# EAGLE schematic hanover-7320-20-01 (EAGLE 9.6.1), part 1 of 4

## Sheet 1 of 7: Logic
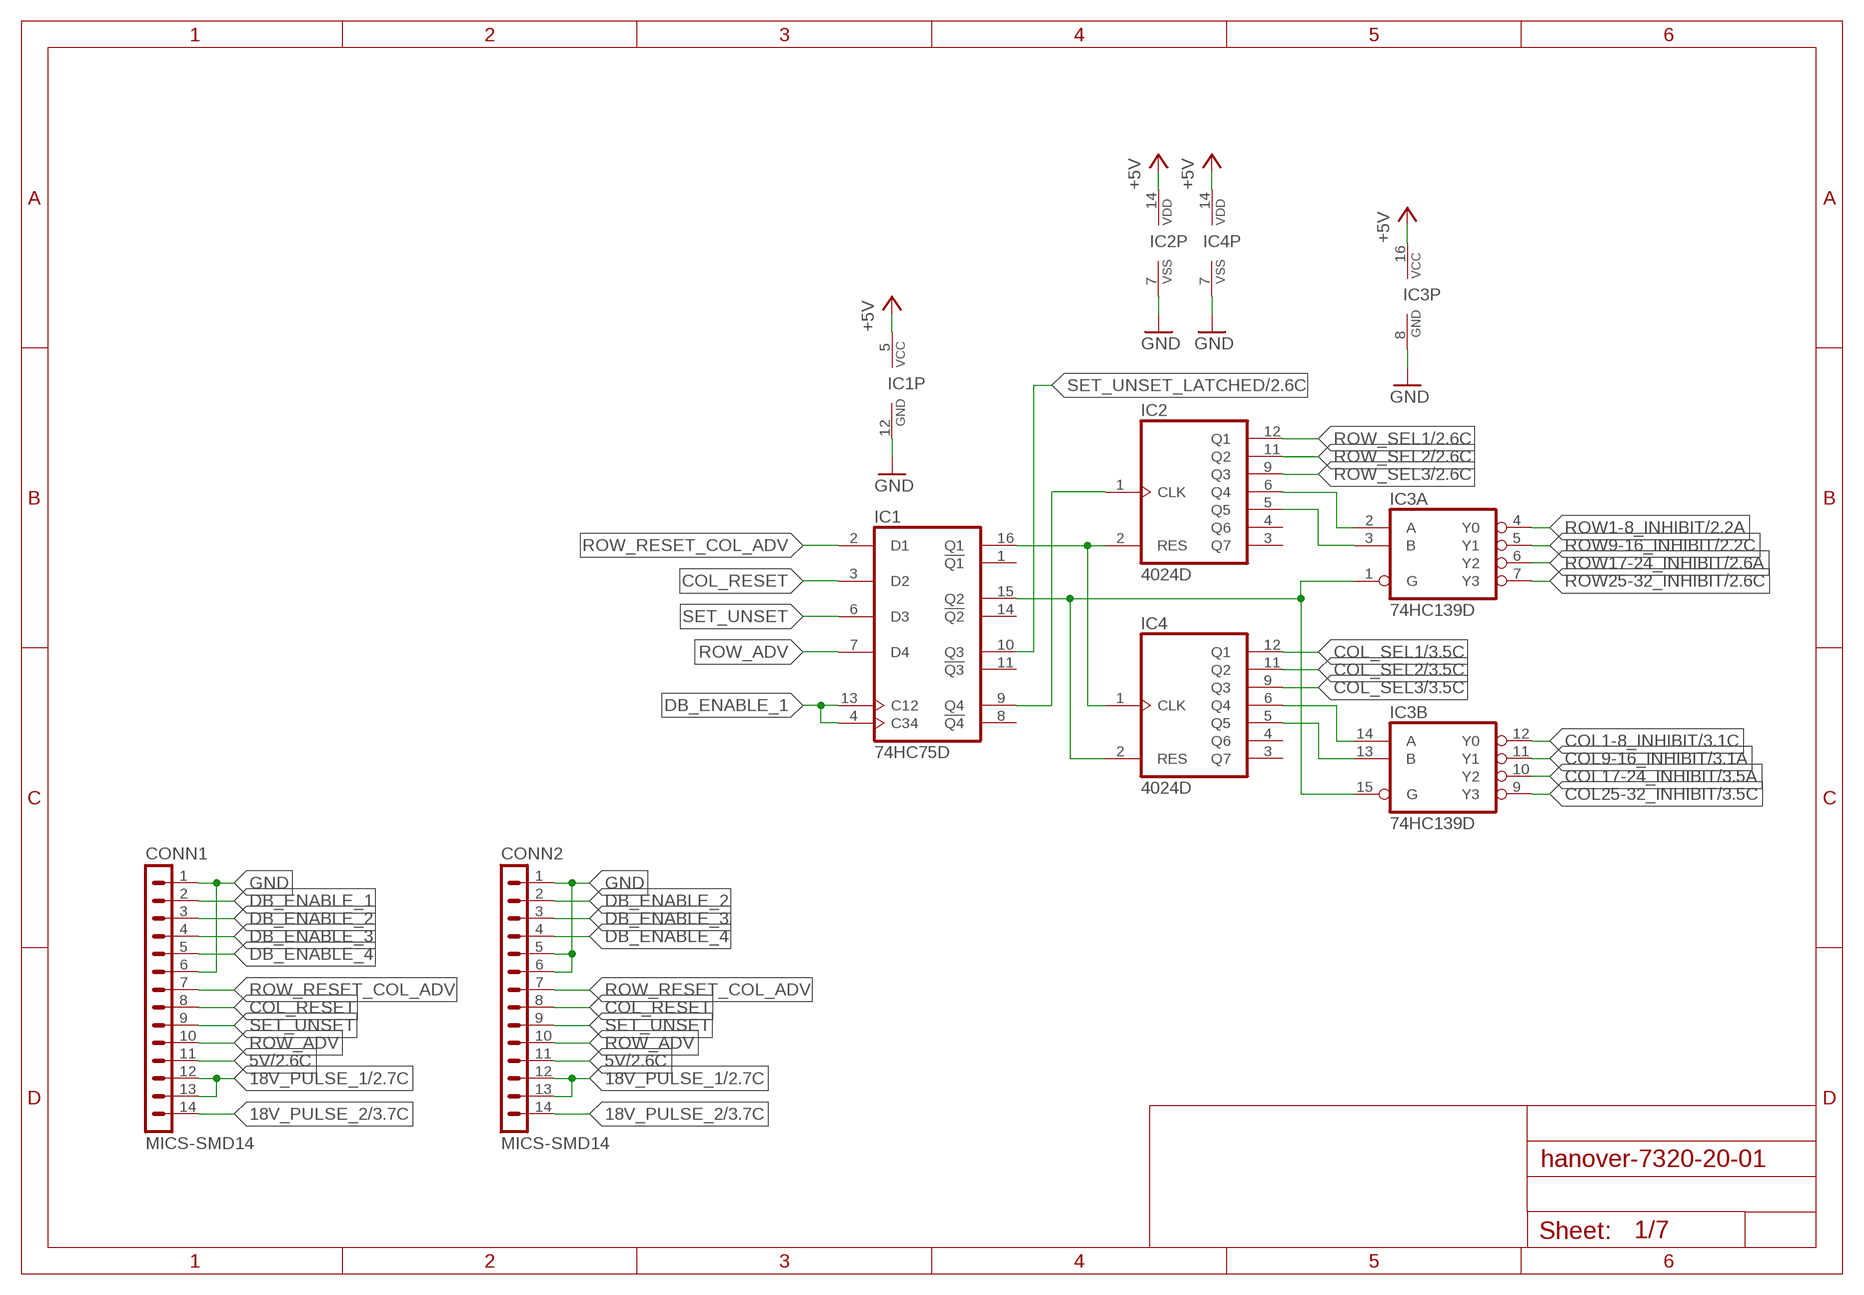
[diagram p0: schematic, sheet 1]

### Parts
CONN1  MICS-SMD14  [MICSMD14]
CONN2  MICS-SMD14  [MICSMD14]
IC1  74HC75D  [SO16]
IC2  4024D  [SO14]
IC3  74HC139D  [SO16]
IC4  4024D  [SO14]

### Nets
5V: CONN1.11 CONN2.11 ; also sheet 2,3
18V_PULSE_1: CONN1.12 CONN1.13 CONN2.12 CONN2.13 ; also sheet 2,3
18V_PULSE_2: CONN1.14 CONN2.14 ; also sheet 3
+5V: IC1.5(VCC) IC2.14(VDD) IC3.16(P:VCC) IC4.14(VDD) ; also sheet 2,3
COL1-8_INHIBIT: IC3.12(B:Y0) ; also sheet 3
COL9-16_INHIBIT: IC3.11(B:Y1) ; also sheet 3
COL17-24_INHIBIT: IC3.10(B:Y2) ; also sheet 3
COL25-32_INHIBIT: IC3.9(B:Y3) ; also sheet 3
COL_RESET: CONN1.8 CONN2.8 IC1.3(D2)
COL_SEL1: IC4.12(Q1) ; also sheet 3
COL_SEL2: IC4.11(Q2) ; also sheet 3
COL_SEL3: IC4.9(Q3) ; also sheet 3
DB_ENABLE_1: CONN1.2 IC1.4(C34) IC1.13(C12)
DB_ENABLE_2: CONN1.3 CONN2.2
DB_ENABLE_3: CONN1.4 CONN2.3
DB_ENABLE_4: CONN1.5 CONN2.4
GND: CONN1.1 CONN1.6 CONN2.1 CONN2.5 CONN2.6 IC1.12(GND) IC2.7(VSS) IC3.8(P:GND) IC4.7(VSS) ; also sheet 2,3
N$1: IC1.9(Q4) IC2.1(CLK)
N$2: IC1.16(Q1) IC2.2(RES) IC4.1(CLK)
N$3: IC1.15(Q2) IC3.1(A:G) IC3.15(B:G) IC4.2(RES)
N$5: IC2.5(Q5) IC3.3(A:B)
N$6: IC3.14(B:A) IC4.6(Q4)
N$7: IC3.13(B:B) IC4.5(Q5)
ROW1-8_INHIBIT: IC3.4(A:Y0) ; also sheet 2
ROW9-16_INHIBIT: IC3.5(A:Y1) ; also sheet 2
ROW17-24_INHIBIT: IC3.6(A:Y2) ; also sheet 2
ROW25-32_INHIBIT: IC3.7(A:Y3) ; also sheet 2
ROW_ADV: CONN1.10 CONN2.10 IC1.7(D4)
ROW_RESET_COL_ADV: CONN1.7 CONN2.7 IC1.2(D1)
ROW_SEL1: IC2.12(Q1) ; also sheet 2
ROW_SEL2: IC2.11(Q2) ; also sheet 2
ROW_SEL3: IC2.9(Q3) ; also sheet 2
ROW_SEL4: IC2.6(Q4) IC3.2(A:A)
SET_UNSET: CONN1.9 CONN2.9 IC1.6(D3)
SET_UNSET_LATCHED: IC1.10(Q3) ; also sheet 2,3
Unconnected: IC1.1(!Q1) IC1.8(!Q4) IC1.11(!Q3) IC1.14(!Q2) IC2.3(Q7) IC2.4(Q6) IC4.3(Q7) IC4.4(Q6)

## Sheet 2 of 7: Row Latches and Drive
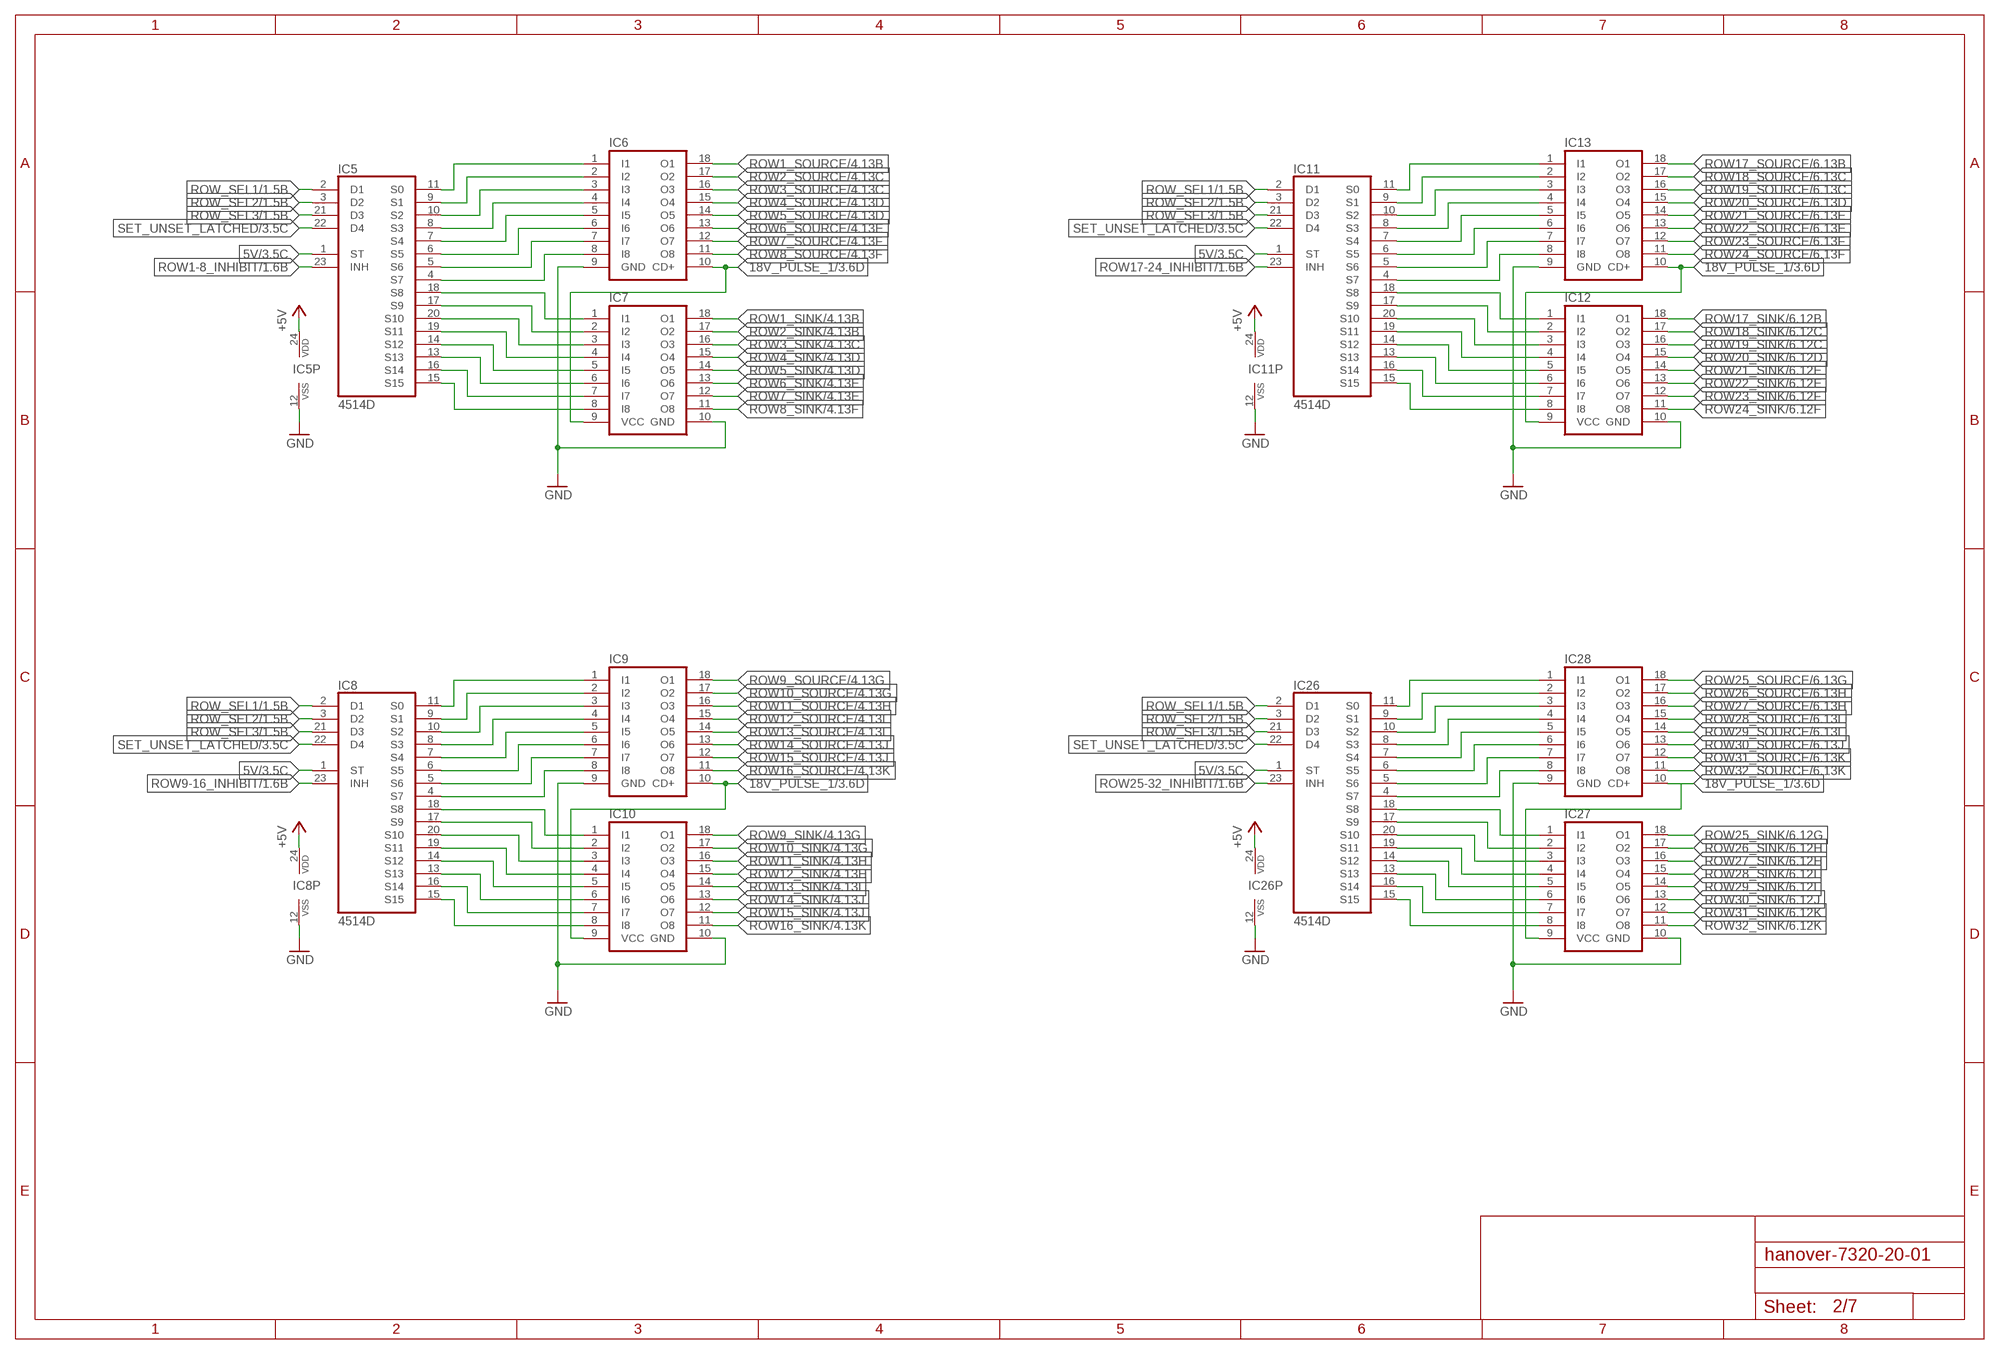
[diagram p1: schematic, sheet 2]

### Parts
IC5  4514D  [SO24W]
IC6  TBD62083AFG  [SOIC127P1030X245-18N]
IC7  TBD62783AFG  [SOIC127P1030X245-18N]
IC8  4514D  [SO24W]
IC9  TBD62083AFG  [SOIC127P1030X245-18N]
IC10  TBD62783AFG  [SOIC127P1030X245-18N]
IC11  4514D  [SO24W]
IC12  TBD62783AFG  [SOIC127P1030X245-18N]
IC13  TBD62083AFG  [SOIC127P1030X245-18N]
IC26  4514D  [SO24W]
IC27  TBD62783AFG  [SOIC127P1030X245-18N]
IC28  TBD62083AFG  [SOIC127P1030X245-18N]

### Nets
5V: IC5.1(ST) IC8.1(ST) IC11.1(ST) IC26.1(ST) ; also sheet 1,3
18V_PULSE_1: IC6.10(CD+) IC7.9(VCC) IC9.10(CD+) IC10.9(VCC) IC12.9(VCC) IC13.10(CD+) IC27.9(VCC) IC28.10(CD+) ; also sheet 1,3
+5V: IC5.24(VDD) IC8.24(VDD) IC11.24(VDD) IC26.24(VDD) ; also sheet 1,3
GND: IC5.12(VSS) IC6.9(GND) IC7.10(GND) IC8.12(VSS) IC9.9(GND) IC10.10(GND) IC11.12(VSS) IC12.10(GND) IC13.9(GND) IC26.12(VSS) IC27.10(GND) IC28.9(GND) ; also sheet 1,3
N$10: IC5.14(S12) IC7.5(I5)
N$12: IC11.14(S12) IC12.5(I5)
N$34: IC8.14(S12) IC10.5(I5)
R1_SINK: IC5.11(S0) IC6.1(I1)
R1_SINK1: IC8.11(S0) IC9.1(I1)
R1_SINK2: IC11.11(S0) IC13.1(I1)
R1_SOURCE: IC5.18(S8) IC7.1(I1)
R1_SOURCE1: IC8.18(S8) IC10.1(I1)
R1_SOURCE2: IC11.18(S8) IC12.1(I1)
R2_SINK: IC5.9(S1) IC6.2(I2)
R2_SINK1: IC8.9(S1) IC9.2(I2)
R2_SINK2: IC11.9(S1) IC13.2(I2)
R2_SOURCE: IC5.17(S9) IC7.2(I2)
R2_SOURCE1: IC8.17(S9) IC10.2(I2)
R2_SOURCE2: IC11.17(S9) IC12.2(I2)
R3_SINK: IC5.10(S2) IC6.3(I3)
R3_SINK1: IC8.10(S2) IC9.3(I3)
R3_SINK2: IC11.10(S2) IC13.3(I3)
R3_SOURCE: IC5.20(S10) IC7.3(I3)
R3_SOURCE1: IC8.20(S10) IC10.3(I3)
R3_SOURCE2: IC11.20(S10) IC12.3(I3)
R4_SINK: IC5.8(S3) IC6.4(I4)
R4_SINK1: IC8.8(S3) IC9.4(I4)
R4_SINK2: IC11.8(S3) IC13.4(I4)
R4_SOURCE: IC5.19(S11) IC7.4(I4)
R4_SOURCE1: IC8.19(S11) IC10.4(I4)
R4_SOURCE2: IC11.19(S11) IC12.4(I4)
R5_SINK: IC5.7(S4) IC6.5(I5)
R5_SINK1: IC8.7(S4) IC9.5(I5)
R5_SINK2: IC11.7(S4) IC13.5(I5)
R6_SINK: IC5.6(S5) IC6.6(I6)
R6_SINK1: IC8.6(S5) IC9.6(I6)
R6_SINK2: IC11.6(S5) IC13.6(I6)
R6_SOURCE: IC5.13(S13) IC7.6(I6)
R6_SOURCE1: IC8.13(S13) IC10.6(I6)
R6_SOURCE2: IC11.13(S13) IC12.6(I6)
R7_SINK: IC5.5(S6) IC6.7(I7)
R7_SINK1: IC8.5(S6) IC9.7(I7)
R7_SINK2: IC11.5(S6) IC13.7(I7)
R7_SOURCE: IC5.16(S14) IC7.7(I7)
R7_SOURCE1: IC8.16(S14) IC10.7(I7)
R7_SOURCE2: IC11.16(S14) IC12.7(I7)
R8_SINK: IC5.4(S7) IC6.8(I8)
R8_SINK1: IC8.4(S7) IC9.8(I8)
R8_SINK2: IC11.4(S7) IC13.8(I8)
R8_SOURCE: IC5.15(S15) IC7.8(I8)
R8_SOURCE1: IC8.15(S15) IC10.8(I8)
R8_SOURCE2: IC11.15(S15) IC12.8(I8)
R25_SINK: IC26.11(S0) IC28.1(I1)
R25_SOURCE: IC26.18(S8) IC27.1(I1)
R26_SINK: IC26.9(S1) IC28.2(I2)
R26_SOURCE: IC26.17(S9) IC27.2(I2)
R27_SINK: IC26.10(S2) IC28.3(I3)
R27_SOURCE: IC26.20(S10) IC27.3(I3)
R28_SINK: IC26.8(S3) IC28.4(I4)
R28_SOURCE: IC26.19(S11) IC27.4(I4)
R29_SINK: IC26.7(S4) IC28.5(I5)
R29_SOURCE: IC26.14(S12) IC27.5(I5)
R30_SINK: IC26.6(S5) IC28.6(I6)
R30_SOURCE: IC26.13(S13) IC27.6(I6)
R31_SINK: IC26.5(S6) IC28.7(I7)
R31_SOURCE: IC26.16(S14) IC27.7(I7)
R32_SINK: IC26.4(S7) IC28.8(I8)
R32_SOURCE: IC26.15(S15) IC27.8(I8)
ROW1-8_INHIBIT: IC5.23(INH) ; also sheet 1
ROW1_SINK: IC7.18(O1) ; also sheet 4,5
ROW1_SOURCE: IC6.18(O1) ; also sheet 4,5
ROW2_SINK: IC7.17(O2) ; also sheet 4,5
ROW2_SOURCE: IC6.17(O2) ; also sheet 4,5
ROW3_SINK: IC7.16(O3) ; also sheet 4,5
ROW3_SOURCE: IC6.16(O3) ; also sheet 4,5
ROW4_SINK: IC7.15(O4) ; also sheet 4,5
ROW4_SOURCE: IC6.15(O4) ; also sheet 4,5
ROW5_SINK: IC7.14(O5) ; also sheet 4,5
ROW5_SOURCE: IC6.14(O5) ; also sheet 4,5
ROW6_SINK: IC7.13(O6) ; also sheet 4,5
ROW6_SOURCE: IC6.13(O6) ; also sheet 4,5
ROW7_SINK: IC7.12(O7) ; also sheet 4,5
ROW7_SOURCE: IC6.12(O7) ; also sheet 4,5
ROW8_SINK: IC7.11(O8) ; also sheet 4,5
ROW8_SOURCE: IC6.11(O8) ; also sheet 4,5
ROW9-16_INHIBIT: IC8.23(INH) ; also sheet 1
ROW9_SINK: IC10.18(O1) ; also sheet 4,5
ROW9_SOURCE: IC9.18(O1) ; also sheet 4,5
ROW10_SINK: IC10.17(O2) ; also sheet 4,5
ROW10_SOURCE: IC9.17(O2) ; also sheet 4,5
ROW11_SINK: IC10.16(O3) ; also sheet 4,5
ROW11_SOURCE: IC9.16(O3) ; also sheet 4,5
ROW12_SINK: IC10.15(O4) ; also sheet 4,5
ROW12_SOURCE: IC9.15(O4) ; also sheet 4,5
ROW13_SINK: IC10.14(O5) ; also sheet 4,5
ROW13_SOURCE: IC9.14(O5) ; also sheet 4,5
ROW14_SINK: IC10.13(O6) ; also sheet 4,5
ROW14_SOURCE: IC9.13(O6) ; also sheet 4,5
ROW15_SINK: IC10.12(O7) ; also sheet 4,5
ROW15_SOURCE: IC9.12(O7) ; also sheet 4,5
ROW16_SINK: IC10.11(O8) ; also sheet 4,5
ROW16_SOURCE: IC9.11(O8) ; also sheet 4,5
ROW17-24_INHIBIT: IC11.23(INH) ; also sheet 1
ROW17_SINK: IC12.18(O1) ; also sheet 6,7
ROW17_SOURCE: IC13.18(O1) ; also sheet 6,7
ROW18_SINK: IC12.17(O2) ; also sheet 6,7
ROW18_SOURCE: IC13.17(O2) ; also sheet 6,7
ROW19_SINK: IC12.16(O3) ; also sheet 6,7
ROW19_SOURCE: IC13.16(O3) ; also sheet 6,7
ROW20_SINK: IC12.15(O4) ; also sheet 6,7
ROW20_SOURCE: IC13.15(O4) ; also sheet 6,7
ROW21_SINK: IC12.14(O5) ; also sheet 6,7
ROW21_SOURCE: IC13.14(O5) ; also sheet 6,7
ROW22_SINK: IC12.13(O6) ; also sheet 6,7
ROW22_SOURCE: IC13.13(O6) ; also sheet 6,7
ROW23_SINK: IC12.12(O7) ; also sheet 6,7
ROW23_SOURCE: IC13.12(O7) ; also sheet 6,7
ROW24_SINK: IC12.11(O8) ; also sheet 6,7
ROW24_SOURCE: IC13.11(O8) ; also sheet 6,7
ROW25-32_INHIBIT: IC26.23(INH) ; also sheet 1
ROW25_SINK: IC27.18(O1) ; also sheet 6,7
ROW25_SOURCE: IC28.18(O1) ; also sheet 6,7
ROW26_SINK: IC27.17(O2) ; also sheet 6,7
ROW26_SOURCE: IC28.17(O2) ; also sheet 6,7
ROW27_SINK: IC27.16(O3) ; also sheet 6,7
ROW27_SOURCE: IC28.16(O3) ; also sheet 6,7
ROW28_SINK: IC27.15(O4) ; also sheet 6,7
ROW28_SOURCE: IC28.15(O4) ; also sheet 6,7
ROW29_SINK: IC27.14(O5) ; also sheet 6,7
ROW29_SOURCE: IC28.14(O5) ; also sheet 6,7
ROW30_SINK: IC27.13(O6) ; also sheet 6,7
ROW30_SOURCE: IC28.13(O6) ; also sheet 6,7
ROW31_SINK: IC27.12(O7) ; also sheet 6,7
ROW31_SOURCE: IC28.12(O7) ; also sheet 6,7
ROW32_SINK: IC27.11(O8) ; also sheet 6,7
ROW32_SOURCE: IC28.11(O8) ; also sheet 6,7
ROW_SEL1: IC5.2(D1) IC8.2(D1) IC11.2(D1) IC26.2(D1) ; also sheet 1
ROW_SEL2: IC5.3(D2) IC8.3(D2) IC11.3(D2) IC26.3(D2) ; also sheet 1
ROW_SEL3: IC5.21(D3) IC8.21(D3) IC11.21(D3) IC26.21(D3) ; also sheet 1
SET_UNSET_LATCHED: IC5.22(D4) IC8.22(D4) IC11.22(D4) IC26.22(D4) ; also sheet 1,3

## Sheet 3 of 7: Column Latches and Drives
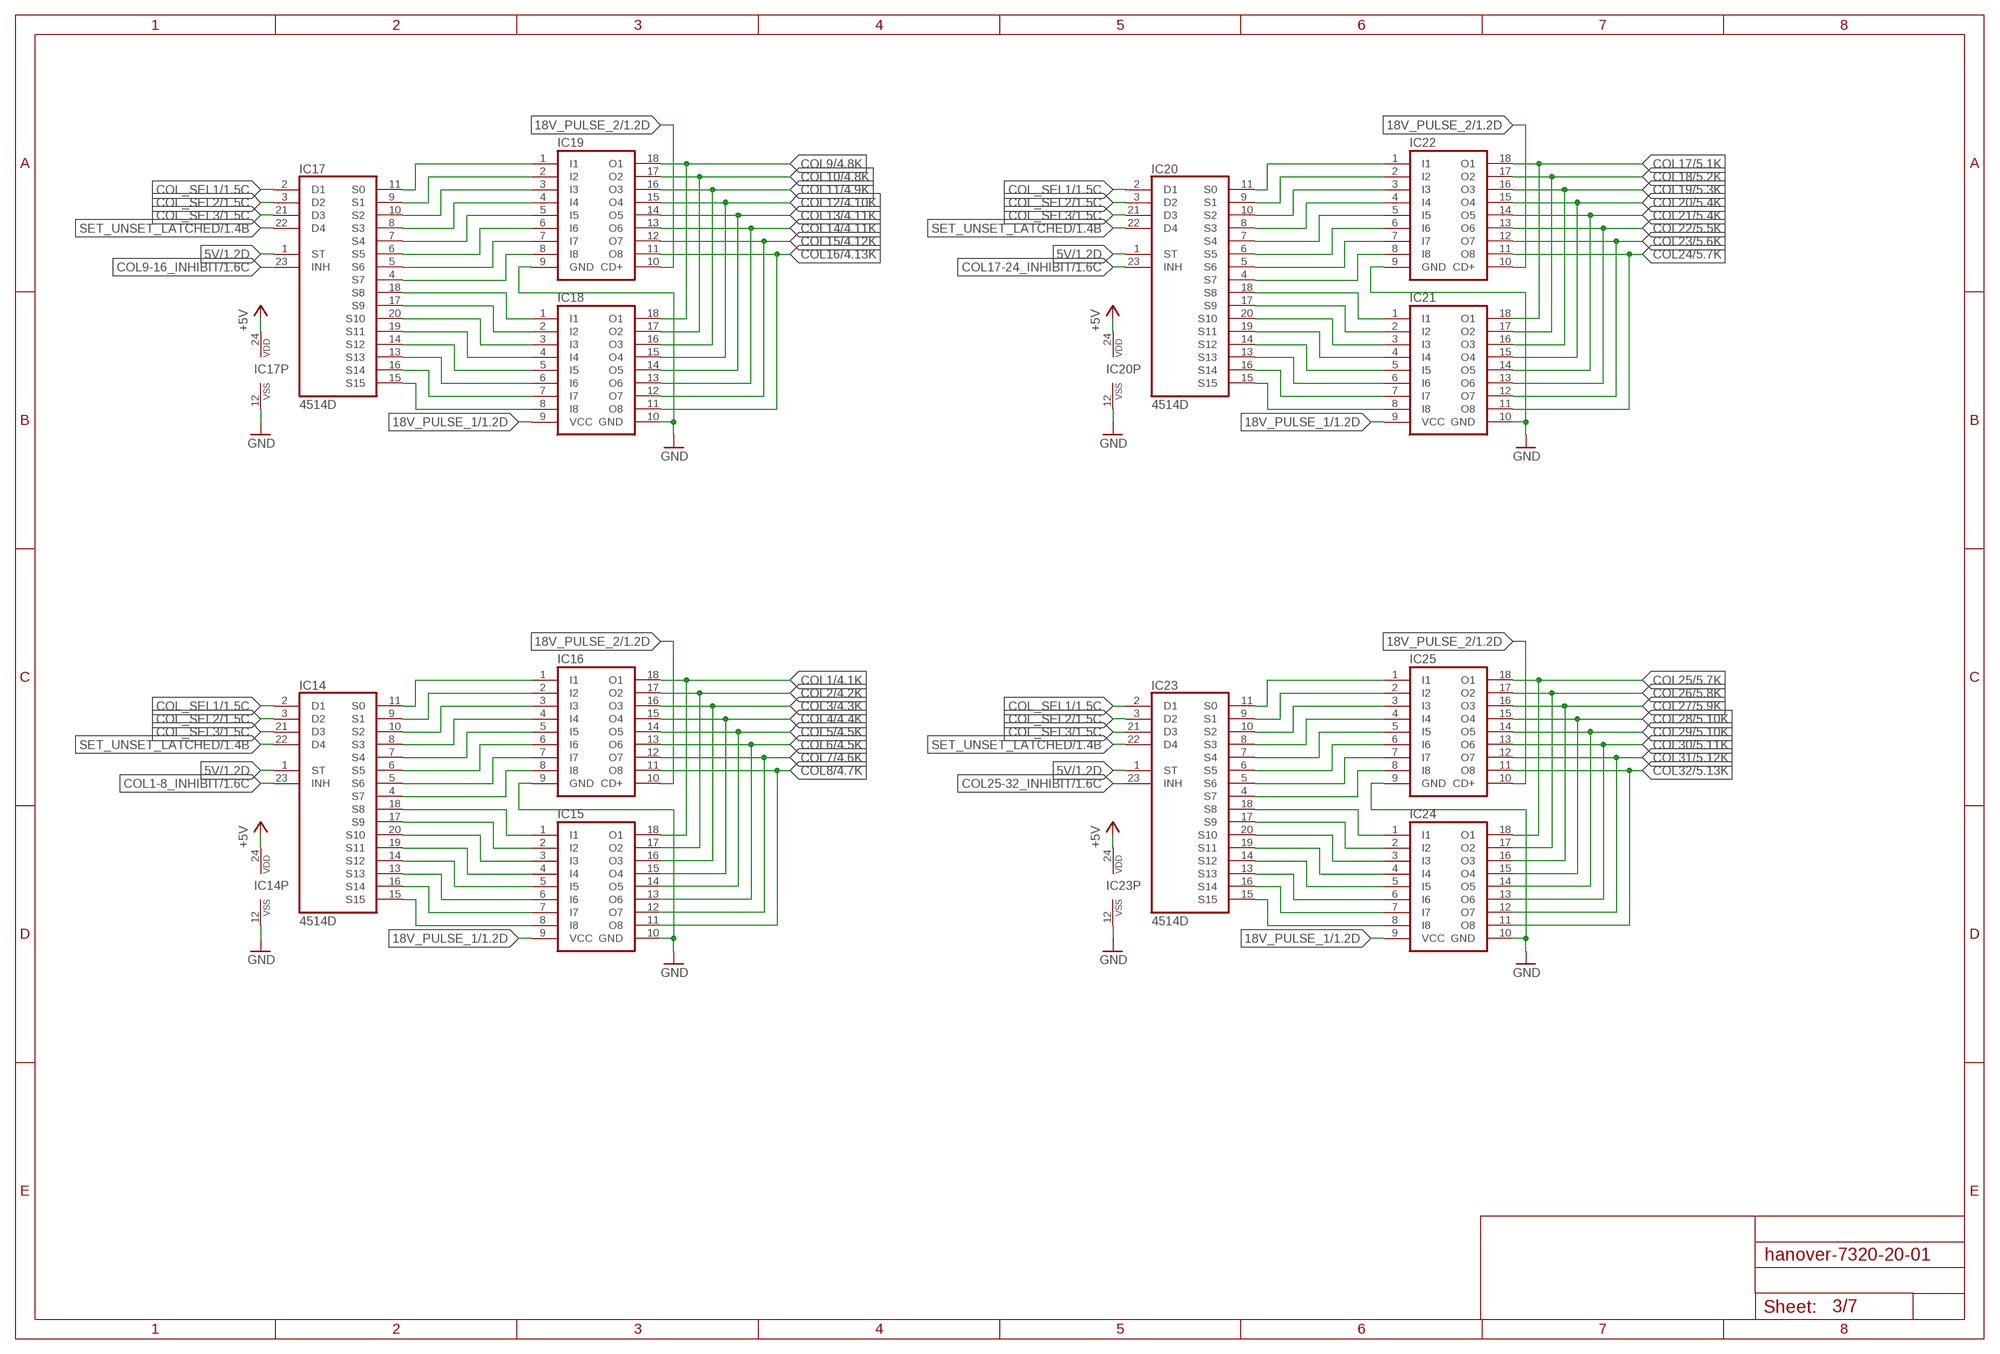
[diagram p2: schematic, sheet 3]

### Parts
IC14  4514D  [SO24W]
IC15  TBD62783AFG  [SOIC127P1030X245-18N]
IC16  TBD62083AFG  [SOIC127P1030X245-18N]
IC17  4514D  [SO24W]
IC18  TBD62783AFG  [SOIC127P1030X245-18N]
IC19  TBD62083AFG  [SOIC127P1030X245-18N]
IC20  4514D  [SO24W]
IC21  TBD62783AFG  [SOIC127P1030X245-18N]
IC22  TBD62083AFG  [SOIC127P1030X245-18N]
IC23  4514D  [SO24W]
IC24  TBD62783AFG  [SOIC127P1030X245-18N]
IC25  TBD62083AFG  [SOIC127P1030X245-18N]

### Nets
5V: IC14.1(ST) IC17.1(ST) IC20.1(ST) IC23.1(ST) ; also sheet 1,2
18V_PULSE_1: IC15.9(VCC) IC18.9(VCC) IC21.9(VCC) IC24.9(VCC) ; also sheet 1,2
18V_PULSE_2: IC16.10(CD+) IC19.10(CD+) IC22.10(CD+) IC25.10(CD+) ; also sheet 1
+5V: IC14.24(VDD) IC17.24(VDD) IC20.24(VDD) IC23.24(VDD) ; also sheet 1,2
C9_SINK: IC17.11(S0) IC19.1(I1)
C9_SOURCE: IC17.18(S8) IC18.1(I1)
C10_SINK: IC17.9(S1) IC19.2(I2)
C10_SOURCE: IC17.17(S9) IC18.2(I2)
C11_SINK: IC17.10(S2) IC19.3(I3)
C11_SOURCE: IC17.20(S10) IC18.3(I3)
C12_SINK: IC17.8(S3) IC19.4(I4)
C12_SOURCE: IC17.19(S11) IC18.4(I4)
C13_SINK: IC17.7(S4) IC19.5(I5)
C14_SINK: IC17.6(S5) IC19.6(I6)
C14_SOURCE: IC17.13(S13) IC18.6(I6)
C15_SINK: IC17.5(S6) IC19.7(I7)
C15_SOURCE: IC17.16(S14) IC18.7(I7)
C16_SINK: IC17.4(S7) IC19.8(I8)
COL1: IC15.18(O1) IC16.18(O1) ; also sheet 4,6
COL1-8_INHIBIT: IC14.23(INH) ; also sheet 1
COL2: IC15.17(O2) IC16.17(O2) ; also sheet 4,6
COL3: IC15.16(O3) IC16.16(O3) ; also sheet 4,6
COL4: IC15.15(O4) IC16.15(O4) ; also sheet 4,6
COL5: IC15.14(O5) IC16.14(O5) ; also sheet 4,6
COL6: IC15.13(O6) IC16.13(O6) ; also sheet 4,6
COL7: IC15.12(O7) IC16.12(O7) ; also sheet 4,6
COL8: IC15.11(O8) IC16.11(O8) ; also sheet 4,6
COL9: IC18.18(O1) IC19.18(O1) ; also sheet 4,6
COL9-16_INHIBIT: IC17.23(INH) ; also sheet 1
COL10: IC18.17(O2) IC19.17(O2) ; also sheet 4,6
COL11: IC18.16(O3) IC19.16(O3) ; also sheet 4,6
COL12: IC18.15(O4) IC19.15(O4) ; also sheet 4,6
COL13: IC18.14(O5) IC19.14(O5) ; also sheet 4,6
COL14: IC18.13(O6) IC19.13(O6) ; also sheet 4,6
COL15: IC18.12(O7) IC19.12(O7) ; also sheet 4,6
COL16: IC18.11(O8) IC19.11(O8) ; also sheet 4,6
COL17: IC21.18(O1) IC22.18(O1) ; also sheet 5,7
COL17-24_INHIBIT: IC20.23(INH) ; also sheet 1
COL18: IC21.17(O2) IC22.17(O2) ; also sheet 5,7
COL19: IC21.16(O3) IC22.16(O3) ; also sheet 5,7
COL20: IC21.15(O4) IC22.15(O4) ; also sheet 5,7
COL21: IC21.14(O5) IC22.14(O5) ; also sheet 5,7
COL22: IC21.13(O6) IC22.13(O6) ; also sheet 5,7
COL23: IC21.12(O7) IC22.12(O7) ; also sheet 5,7
COL24: IC21.11(O8) IC22.11(O8) ; also sheet 5,7
COL25: IC24.18(O1) IC25.18(O1) ; also sheet 5,7
COL25-32_INHIBIT: IC23.23(INH) ; also sheet 1
COL26: IC24.17(O2) IC25.17(O2) ; also sheet 5,7
COL27: IC24.16(O3) IC25.16(O3) ; also sheet 5,7
COL28: IC24.15(O4) IC25.15(O4) ; also sheet 5,7
COL29: IC24.14(O5) IC25.14(O5) ; also sheet 5,7
COL30: IC24.13(O6) IC25.13(O6) ; also sheet 5,7
COL31: IC24.12(O7) IC25.12(O7) ; also sheet 5,7
COL32: IC24.11(O8) IC25.11(O8) ; also sheet 5,7
COL_SEL1: IC14.2(D1) IC17.2(D1) IC20.2(D1) IC23.2(D1) ; also sheet 1
COL_SEL2: IC14.3(D2) IC17.3(D2) IC20.3(D2) IC23.3(D2) ; also sheet 1
COL_SEL3: IC14.21(D3) IC17.21(D3) IC20.21(D3) IC23.21(D3) ; also sheet 1
GND: IC14.12(VSS) IC15.10(GND) IC16.9(GND) IC17.12(VSS) IC18.10(GND) IC19.9(GND) IC20.12(VSS) IC21.10(GND) IC22.9(GND) IC23.12(VSS) IC24.10(GND) IC25.9(GND) ; also sheet 1,2
N$11: IC14.14(S12) IC15.5(I5)
N$13: IC17.14(S12) IC18.5(I5)
N$14: IC20.14(S12) IC21.5(I5)
R1_SINK4: IC14.11(S0) IC16.1(I1)
R1_SINK6: IC20.11(S0) IC22.1(I1)
R1_SOURCE4: IC14.18(S8) IC15.1(I1)
R1_SOURCE6: IC20.18(S8) IC21.1(I1)
R2_SINK4: IC14.9(S1) IC16.2(I2)
R2_SINK6: IC20.9(S1) IC22.2(I2)
R2_SOURCE4: IC14.17(S9) IC15.2(I2)
R2_SOURCE6: IC20.17(S9) IC21.2(I2)
R3_SINK4: IC14.10(S2) IC16.3(I3)
R3_SINK6: IC20.10(S2) IC22.3(I3)
R3_SOURCE4: IC14.20(S10) IC15.3(I3)
R3_SOURCE6: IC20.20(S10) IC21.3(I3)
R4_SINK4: IC14.8(S3) IC16.4(I4)
R4_SINK6: IC20.8(S3) IC22.4(I4)
R4_SOURCE4: IC14.19(S11) IC15.4(I4)
R4_SOURCE6: IC20.19(S11) IC21.4(I4)
R5_SINK4: IC14.7(S4) IC16.5(I5)
R5_SINK6: IC20.7(S4) IC22.5(I5)
R6_SINK4: IC14.6(S5) IC16.6(I6)
R6_SINK6: IC20.6(S5) IC22.6(I6)
R6_SOURCE4: IC14.13(S13) IC15.6(I6)
R6_SOURCE6: IC20.13(S13) IC21.6(I6)
R7_SINK4: IC14.5(S6) IC16.7(I7)
R7_SINK6: IC20.5(S6) IC22.7(I7)
R7_SOURCE4: IC14.16(S14) IC15.7(I7)
R7_SOURCE6: IC20.16(S14) IC21.7(I7)
R8_SINK4: IC14.4(S7) IC16.8(I8)
R8_SINK6: IC20.4(S7) IC22.8(I8)
R8_SOURCE4: IC14.15(S15) IC15.8(I8)
R8_SOURCE5: IC17.15(S15) IC18.8(I8)
R8_SOURCE6: IC20.15(S15) IC21.8(I8)
R25_SINK1: IC23.11(S0) IC25.1(I1)
R25_SOURCE1: IC23.18(S8) IC24.1(I1)
R26_SINK1: IC23.9(S1) IC25.2(I2)
R26_SOURCE1: IC23.17(S9) IC24.2(I2)
R27_SINK1: IC23.10(S2) IC25.3(I3)
R27_SOURCE1: IC23.20(S10) IC24.3(I3)
R28_SINK1: IC23.8(S3) IC25.4(I4)
R28_SOURCE1: IC23.19(S11) IC24.4(I4)
R29_SINK1: IC23.7(S4) IC25.5(I5)
R29_SOURCE1: IC23.14(S12) IC24.5(I5)
R30_SINK1: IC23.6(S5) IC25.6(I6)
R30_SOURCE1: IC23.13(S13) IC24.6(I6)
R31_SINK1: IC23.5(S6) IC25.7(I7)
R31_SOURCE1: IC23.16(S14) IC24.7(I7)
R32_SINK1: IC23.4(S7) IC25.8(I8)
R32_SOURCE1: IC23.15(S15) IC24.8(I8)
SET_UNSET_LATCHED: IC14.22(D4) IC17.22(D4) IC20.22(D4) IC23.22(D4) ; also sheet 1,2

## Sheet 4 of 7: Dots R1-16 C1-16
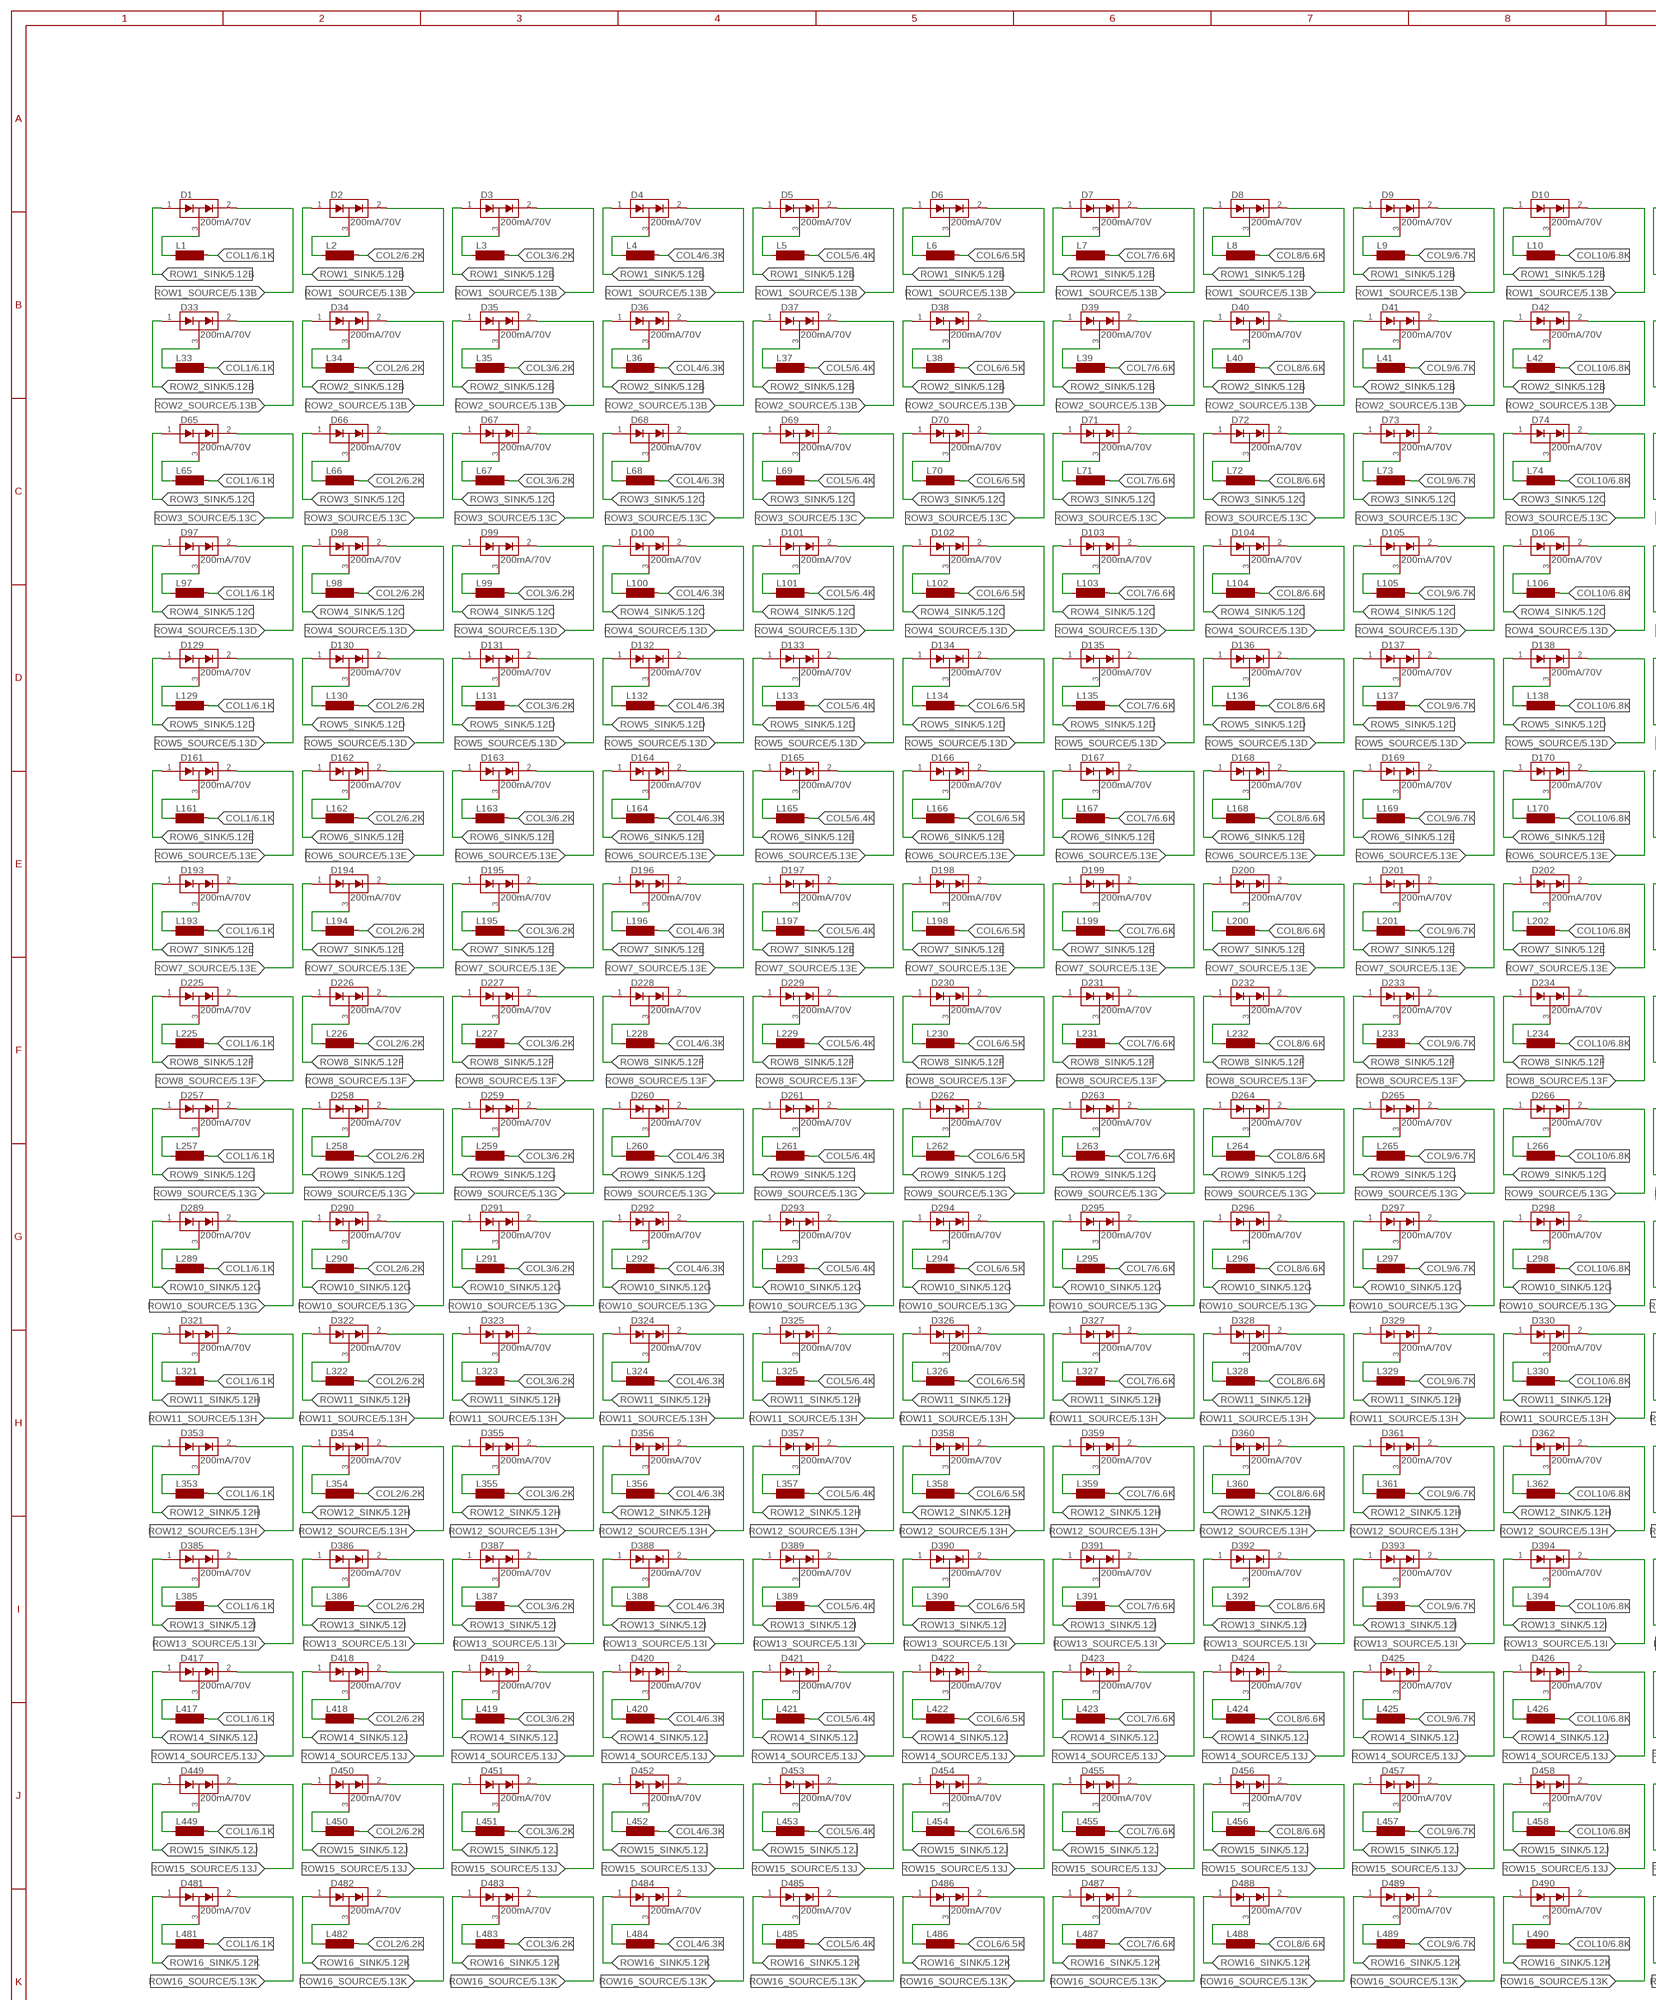
[diagram p3: schematic, sheet 4, part 1 of 3]
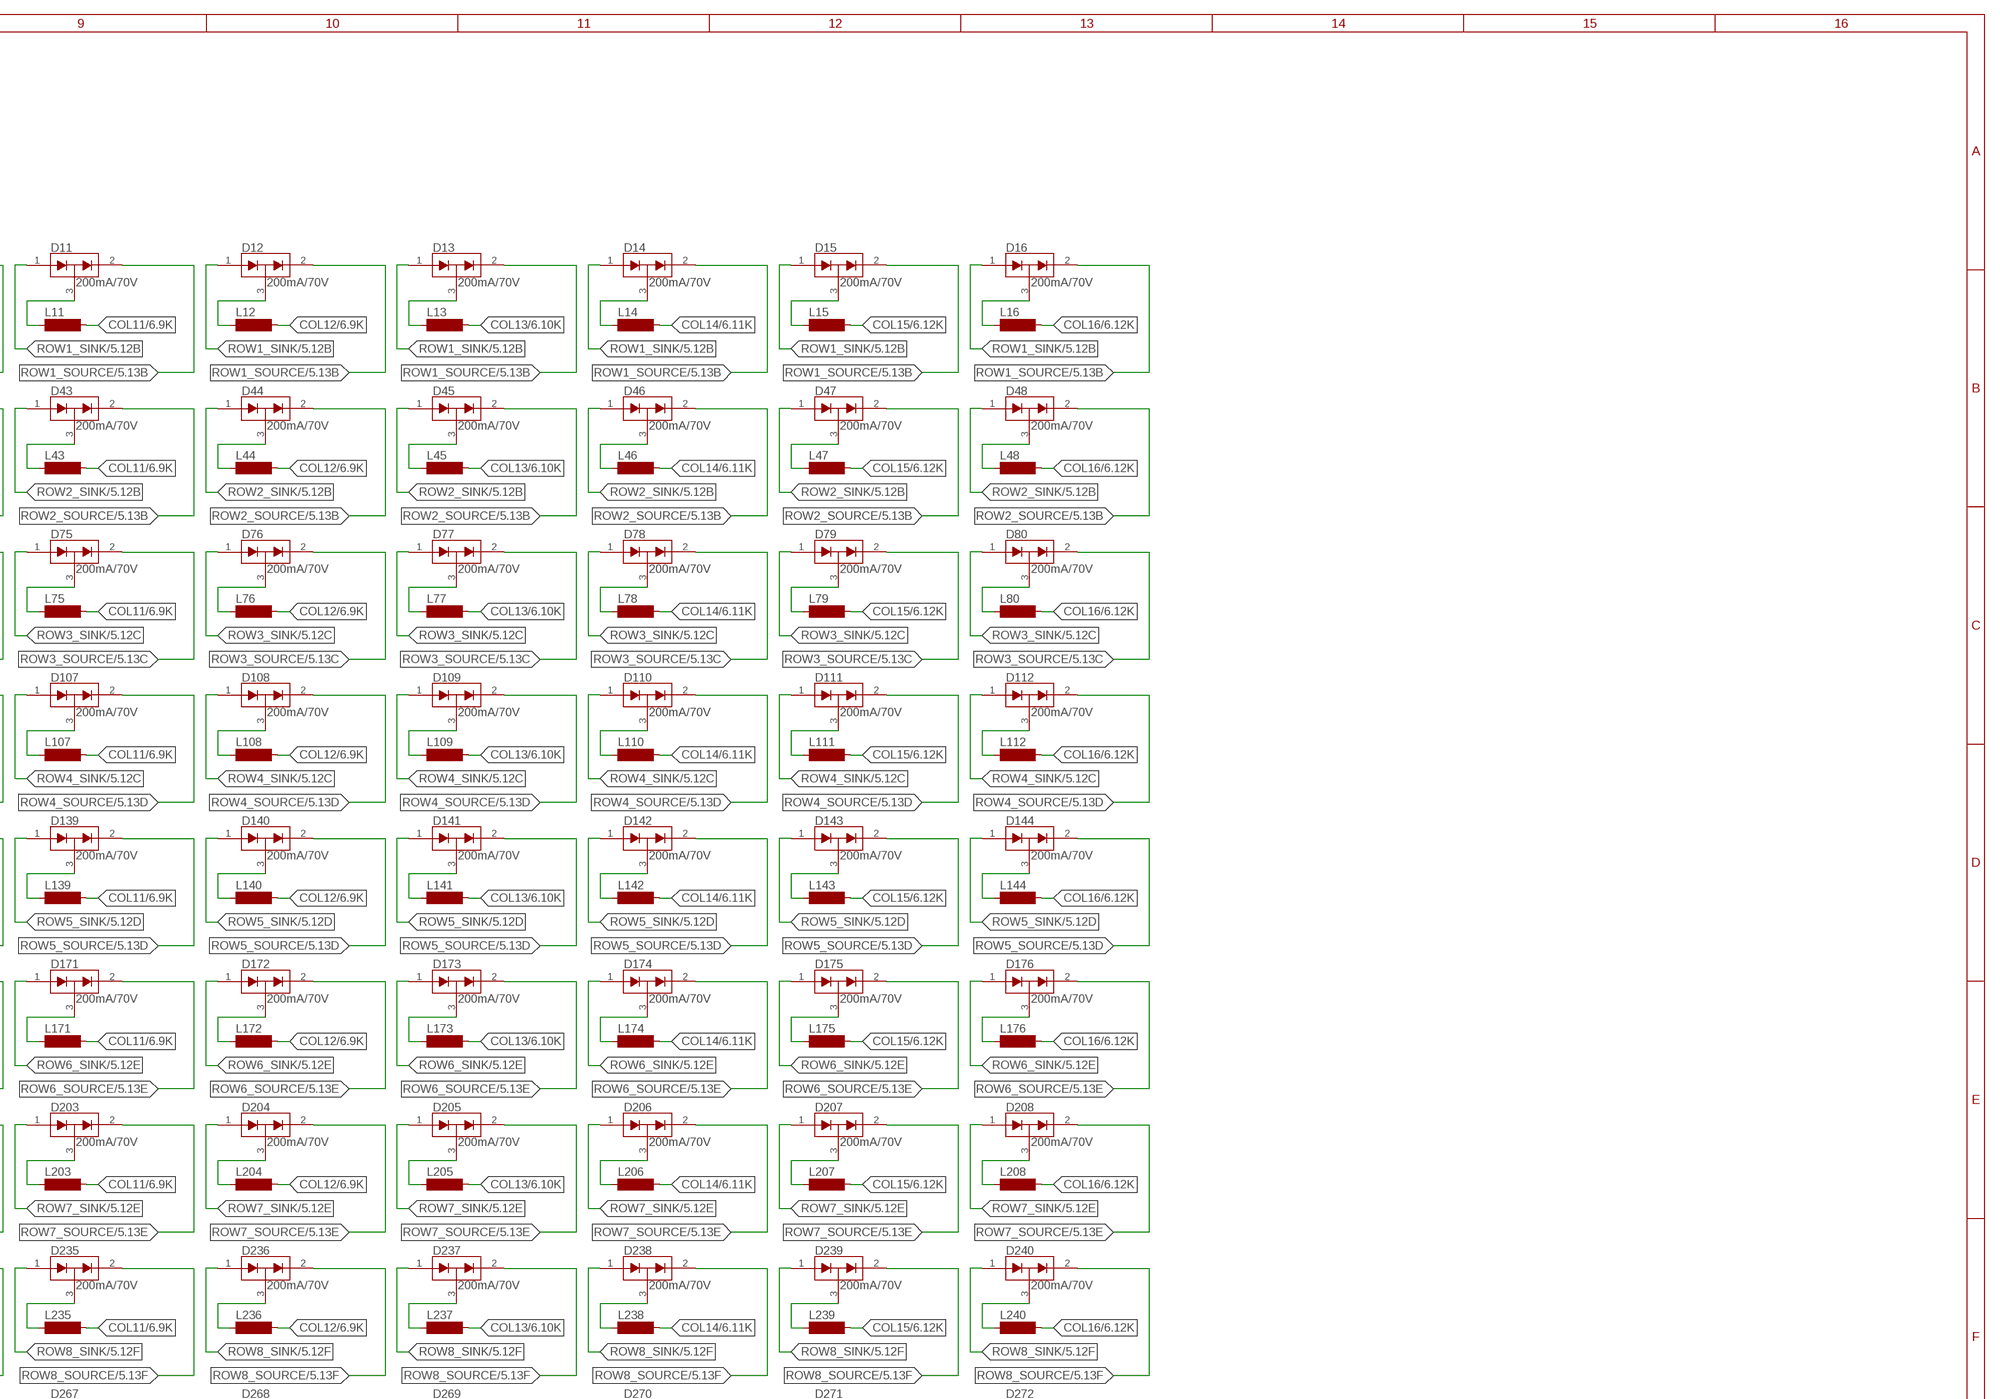
[diagram p4: schematic, sheet 4, part 2 of 3]
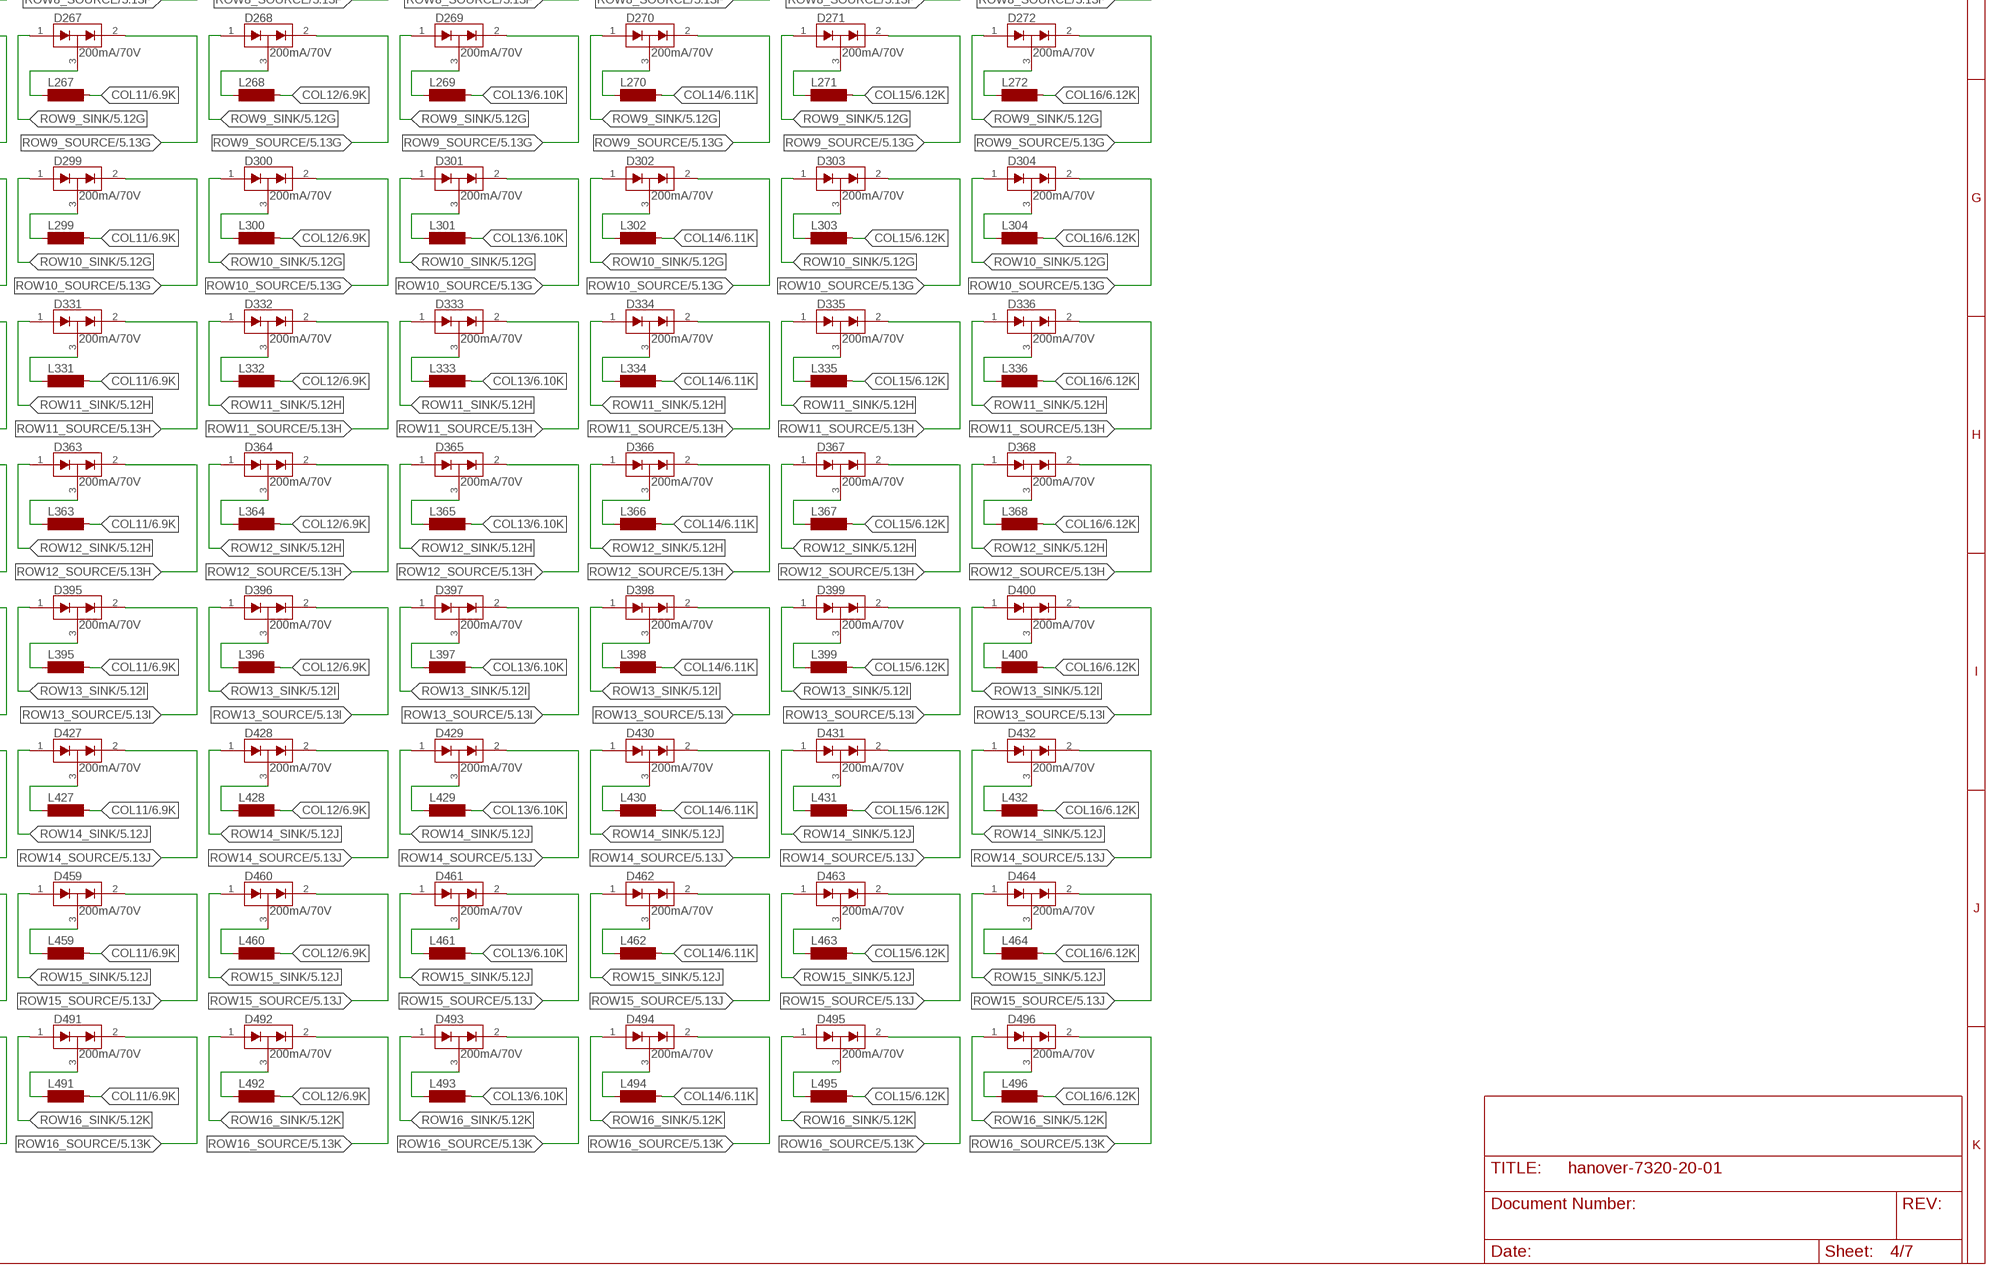
[diagram p5: schematic, sheet 4, part 3 of 3]

### Parts
D1  200mA/70V  BAV99  [SOT23-3]
D2  200mA/70V  BAV99  [SOT23-3]
D3  200mA/70V  BAV99  [SOT23-3]
D4  200mA/70V  BAV99  [SOT23-3]
D5  200mA/70V  BAV99  [SOT23-3]
D6  200mA/70V  BAV99  [SOT23-3]
D7  200mA/70V  BAV99  [SOT23-3]
D8  200mA/70V  BAV99  [SOT23-3]
D9  200mA/70V  BAV99  [SOT23-3]
D10  200mA/70V  BAV99  [SOT23-3]
D11  200mA/70V  BAV99  [SOT23-3]
D12  200mA/70V  BAV99  [SOT23-3]
D13  200mA/70V  BAV99  [SOT23-3]
D14  200mA/70V  BAV99  [SOT23-3]
D15  200mA/70V  BAV99  [SOT23-3]
D16  200mA/70V  BAV99  [SOT23-3]
D33  200mA/70V  BAV99  [SOT23-3]
D34  200mA/70V  BAV99  [SOT23-3]
D35  200mA/70V  BAV99  [SOT23-3]
D36  200mA/70V  BAV99  [SOT23-3]
D37  200mA/70V  BAV99  [SOT23-3]
D38  200mA/70V  BAV99  [SOT23-3]
D39  200mA/70V  BAV99  [SOT23-3]
D40  200mA/70V  BAV99  [SOT23-3]
D41  200mA/70V  BAV99  [SOT23-3]
D42  200mA/70V  BAV99  [SOT23-3]
D43  200mA/70V  BAV99  [SOT23-3]
D44  200mA/70V  BAV99  [SOT23-3]
D45  200mA/70V  BAV99  [SOT23-3]
D46  200mA/70V  BAV99  [SOT23-3]
D47  200mA/70V  BAV99  [SOT23-3]
D48  200mA/70V  BAV99  [SOT23-3]
D65  200mA/70V  BAV99  [SOT23-3]
D66  200mA/70V  BAV99  [SOT23-3]
D67  200mA/70V  BAV99  [SOT23-3]
D68  200mA/70V  BAV99  [SOT23-3]
D69  200mA/70V  BAV99  [SOT23-3]
D70  200mA/70V  BAV99  [SOT23-3]
D71  200mA/70V  BAV99  [SOT23-3]
D72  200mA/70V  BAV99  [SOT23-3]
D73  200mA/70V  BAV99  [SOT23-3]
D74  200mA/70V  BAV99  [SOT23-3]
D75  200mA/70V  BAV99  [SOT23-3]
D76  200mA/70V  BAV99  [SOT23-3]
D77  200mA/70V  BAV99  [SOT23-3]
D78  200mA/70V  BAV99  [SOT23-3]
D79  200mA/70V  BAV99  [SOT23-3]
D80  200mA/70V  BAV99  [SOT23-3]
D97  200mA/70V  BAV99  [SOT23-3]
D98  200mA/70V  BAV99  [SOT23-3]
D99  200mA/70V  BAV99  [SOT23-3]
D100  200mA/70V  BAV99  [SOT23-3]
D101  200mA/70V  BAV99  [SOT23-3]
D102  200mA/70V  BAV99  [SOT23-3]
D103  200mA/70V  BAV99  [SOT23-3]
D104  200mA/70V  BAV99  [SOT23-3]
D105  200mA/70V  BAV99  [SOT23-3]
D106  200mA/70V  BAV99  [SOT23-3]
D107  200mA/70V  BAV99  [SOT23-3]
D108  200mA/70V  BAV99  [SOT23-3]
D109  200mA/70V  BAV99  [SOT23-3]
D110  200mA/70V  BAV99  [SOT23-3]
D111  200mA/70V  BAV99  [SOT23-3]
D112  200mA/70V  BAV99  [SOT23-3]
D129  200mA/70V  BAV99  [SOT23-3]
D130  200mA/70V  BAV99  [SOT23-3]
D131  200mA/70V  BAV99  [SOT23-3]
D132  200mA/70V  BAV99  [SOT23-3]
D133  200mA/70V  BAV99  [SOT23-3]
D134  200mA/70V  BAV99  [SOT23-3]
D135  200mA/70V  BAV99  [SOT23-3]
D136  200mA/70V  BAV99  [SOT23-3]
D137  200mA/70V  BAV99  [SOT23-3]
D138  200mA/70V  BAV99  [SOT23-3]
D139  200mA/70V  BAV99  [SOT23-3]
D140  200mA/70V  BAV99  [SOT23-3]
D141  200mA/70V  BAV99  [SOT23-3]
D142  200mA/70V  BAV99  [SOT23-3]
D143  200mA/70V  BAV99  [SOT23-3]
D144  200mA/70V  BAV99  [SOT23-3]
D161  200mA/70V  BAV99  [SOT23-3]
D162  200mA/70V  BAV99  [SOT23-3]
D163  200mA/70V  BAV99  [SOT23-3]
D164  200mA/70V  BAV99  [SOT23-3]
D165  200mA/70V  BAV99  [SOT23-3]
D166  200mA/70V  BAV99  [SOT23-3]
D167  200mA/70V  BAV99  [SOT23-3]
D168  200mA/70V  BAV99  [SOT23-3]
D169  200mA/70V  BAV99  [SOT23-3]
D170  200mA/70V  BAV99  [SOT23-3]
D171  200mA/70V  BAV99  [SOT23-3]
D172  200mA/70V  BAV99  [SOT23-3]
D173  200mA/70V  BAV99  [SOT23-3]
D174  200mA/70V  BAV99  [SOT23-3]
D175  200mA/70V  BAV99  [SOT23-3]
D176  200mA/70V  BAV99  [SOT23-3]
D193  200mA/70V  BAV99  [SOT23-3]
D194  200mA/70V  BAV99  [SOT23-3]
D195  200mA/70V  BAV99  [SOT23-3]
D196  200mA/70V  BAV99  [SOT23-3]
D197  200mA/70V  BAV99  [SOT23-3]
D198  200mA/70V  BAV99  [SOT23-3]
D199  200mA/70V  BAV99  [SOT23-3]
D200  200mA/70V  BAV99  [SOT23-3]
D201  200mA/70V  BAV99  [SOT23-3]
D202  200mA/70V  BAV99  [SOT23-3]
D203  200mA/70V  BAV99  [SOT23-3]
D204  200mA/70V  BAV99  [SOT23-3]
D205  200mA/70V  BAV99  [SOT23-3]
D206  200mA/70V  BAV99  [SOT23-3]
D207  200mA/70V  BAV99  [SOT23-3]
D208  200mA/70V  BAV99  [SOT23-3]
D225  200mA/70V  BAV99  [SOT23-3]
D226  200mA/70V  BAV99  [SOT23-3]
D227  200mA/70V  BAV99  [SOT23-3]
D228  200mA/70V  BAV99  [SOT23-3]
D229  200mA/70V  BAV99  [SOT23-3]
D230  200mA/70V  BAV99  [SOT23-3]
D231  200mA/70V  BAV99  [SOT23-3]
D232  200mA/70V  BAV99  [SOT23-3]
D233  200mA/70V  BAV99  [SOT23-3]
D234  200mA/70V  BAV99  [SOT23-3]
D235  200mA/70V  BAV99  [SOT23-3]
D236  200mA/70V  BAV99  [SOT23-3]
D237  200mA/70V  BAV99  [SOT23-3]
D238  200mA/70V  BAV99  [SOT23-3]
D239  200mA/70V  BAV99  [SOT23-3]
D240  200mA/70V  BAV99  [SOT23-3]
D257  200mA/70V  BAV99  [SOT23-3]
D258  200mA/70V  BAV99  [SOT23-3]
D259  200mA/70V  BAV99  [SOT23-3]
D260  200mA/70V  BAV99  [SOT23-3]
D261  200mA/70V  BAV99  [SOT23-3]
D262  200mA/70V  BAV99  [SOT23-3]
D263  200mA/70V  BAV99  [SOT23-3]
D264  200mA/70V  BAV99  [SOT23-3]
D265  200mA/70V  BAV99  [SOT23-3]
D266  200mA/70V  BAV99  [SOT23-3]
D267  200mA/70V  BAV99  [SOT23-3]
D268  200mA/70V  BAV99  [SOT23-3]
D269  200mA/70V  BAV99  [SOT23-3]
D270  200mA/70V  BAV99  [SOT23-3]
D271  200mA/70V  BAV99  [SOT23-3]
D272  200mA/70V  BAV99  [SOT23-3]
D289  200mA/70V  BAV99  [SOT23-3]
D290  200mA/70V  BAV99  [SOT23-3]
D291  200mA/70V  BAV99  [SOT23-3]
D292  200mA/70V  BAV99  [SOT23-3]
D293  200mA/70V  BAV99  [SOT23-3]
D294  200mA/70V  BAV99  [SOT23-3]
D295  200mA/70V  BAV99  [SOT23-3]
D296  200mA/70V  BAV99  [SOT23-3]
D297  200mA/70V  BAV99  [SOT23-3]
D298  200mA/70V  BAV99  [SOT23-3]
D299  200mA/70V  BAV99  [SOT23-3]
D300  200mA/70V  BAV99  [SOT23-3]
D301  200mA/70V  BAV99  [SOT23-3]
D302  200mA/70V  BAV99  [SOT23-3]
D303  200mA/70V  BAV99  [SOT23-3]
D304  200mA/70V  BAV99  [SOT23-3]
D321  200mA/70V  BAV99  [SOT23-3]
D322  200mA/70V  BAV99  [SOT23-3]
D323  200mA/70V  BAV99  [SOT23-3]
D324  200mA/70V  BAV99  [SOT23-3]
D325  200mA/70V  BAV99  [SOT23-3]
D326  200mA/70V  BAV99  [SOT23-3]
D327  200mA/70V  BAV99  [SOT23-3]
D328  200mA/70V  BAV99  [SOT23-3]
D329  200mA/70V  BAV99  [SOT23-3]
D330  200mA/70V  BAV99  [SOT23-3]
D331  200mA/70V  BAV99  [SOT23-3]
D332  200mA/70V  BAV99  [SOT23-3]
D333  200mA/70V  BAV99  [SOT23-3]
D334  200mA/70V  BAV99  [SOT23-3]
D335  200mA/70V  BAV99  [SOT23-3]
D336  200mA/70V  BAV99  [SOT23-3]
D353  200mA/70V  BAV99  [SOT23-3]
D354  200mA/70V  BAV99  [SOT23-3]
D355  200mA/70V  BAV99  [SOT23-3]
D356  200mA/70V  BAV99  [SOT23-3]
D357  200mA/70V  BAV99  [SOT23-3]
D358  200mA/70V  BAV99  [SOT23-3]
D359  200mA/70V  BAV99  [SOT23-3]
D360  200mA/70V  BAV99  [SOT23-3]
D361  200mA/70V  BAV99  [SOT23-3]
D362  200mA/70V  BAV99  [SOT23-3]
D363  200mA/70V  BAV99  [SOT23-3]
D364  200mA/70V  BAV99  [SOT23-3]
D365  200mA/70V  BAV99  [SOT23-3]
D366  200mA/70V  BAV99  [SOT23-3]
D367  200mA/70V  BAV99  [SOT23-3]
D368  200mA/70V  BAV99  [SOT23-3]
D385  200mA/70V  BAV99  [SOT23-3]
D386  200mA/70V  BAV99  [SOT23-3]
D387  200mA/70V  BAV99  [SOT23-3]
D388  200mA/70V  BAV99  [SOT23-3]
D389  200mA/70V  BAV99  [SOT23-3]
D390  200mA/70V  BAV99  [SOT23-3]
D391  200mA/70V  BAV99  [SOT23-3]
D392  200mA/70V  BAV99  [SOT23-3]
D393  200mA/70V  BAV99  [SOT23-3]
D394  200mA/70V  BAV99  [SOT23-3]
D395  200mA/70V  BAV99  [SOT23-3]
D396  200mA/70V  BAV99  [SOT23-3]
D397  200mA/70V  BAV99  [SOT23-3]
D398  200mA/70V  BAV99  [SOT23-3]
D399  200mA/70V  BAV99  [SOT23-3]
D400  200mA/70V  BAV99  [SOT23-3]
D417  200mA/70V  BAV99  [SOT23-3]
D418  200mA/70V  BAV99  [SOT23-3]
D419  200mA/70V  BAV99  [SOT23-3]
D420  200mA/70V  BAV99  [SOT23-3]
D421  200mA/70V  BAV99  [SOT23-3]
D422  200mA/70V  BAV99  [SOT23-3]
D423  200mA/70V  BAV99  [SOT23-3]
D424  200mA/70V  BAV99  [SOT23-3]
D425  200mA/70V  BAV99  [SOT23-3]
D426  200mA/70V  BAV99  [SOT23-3]
D427  200mA/70V  BAV99  [SOT23-3]
D428  200mA/70V  BAV99  [SOT23-3]
D429  200mA/70V  BAV99  [SOT23-3]
D430  200mA/70V  BAV99  [SOT23-3]
D431  200mA/70V  BAV99  [SOT23-3]
D432  200mA/70V  BAV99  [SOT23-3]
D449  200mA/70V  BAV99  [SOT23-3]
D450  200mA/70V  BAV99  [SOT23-3]
D451  200mA/70V  BAV99  [SOT23-3]
D452  200mA/70V  BAV99  [SOT23-3]
D453  200mA/70V  BAV99  [SOT23-3]
D454  200mA/70V  BAV99  [SOT23-3]
D455  200mA/70V  BAV99  [SOT23-3]
D456  200mA/70V  BAV99  [SOT23-3]
D457  200mA/70V  BAV99  [SOT23-3]
D458  200mA/70V  BAV99  [SOT23-3]
D459  200mA/70V  BAV99  [SOT23-3]
D460  200mA/70V  BAV99  [SOT23-3]
D461  200mA/70V  BAV99  [SOT23-3]
D462  200mA/70V  BAV99  [SOT23-3]
D463  200mA/70V  BAV99  [SOT23-3]
D464  200mA/70V  BAV99  [SOT23-3]
D481  200mA/70V  BAV99  [SOT23-3]
D482  200mA/70V  BAV99  [SOT23-3]
D483  200mA/70V  BAV99  [SOT23-3]
D484  200mA/70V  BAV99  [SOT23-3]
D485  200mA/70V  BAV99  [SOT23-3]
D486  200mA/70V  BAV99  [SOT23-3]
D487  200mA/70V  BAV99  [SOT23-3]
D488  200mA/70V  BAV99  [SOT23-3]
D489  200mA/70V  BAV99  [SOT23-3]
D490  200mA/70V  BAV99  [SOT23-3]
D491  200mA/70V  BAV99  [SOT23-3]
D492  200mA/70V  BAV99  [SOT23-3]
D493  200mA/70V  BAV99  [SOT23-3]
D494  200mA/70V  BAV99  [SOT23-3]
D495  200mA/70V  BAV99  [SOT23-3]
D496  200mA/70V  BAV99  [SOT23-3]
L1  SD8  [SD8]
L2  SD8  [SD8]
L3  SD8  [SD8]
L4  SD8  [SD8]
L5  SD8  [SD8]
L6  SD8  [SD8]
L7  SD8  [SD8]
L8  SD8  [SD8]
L9  SD8  [SD8]
L10  SD8  [SD8]
L11  SD8  [SD8]
L12  SD8  [SD8]
L13  SD8  [SD8]
L14  SD8  [SD8]
L15  SD8  [SD8]
L16  SD8  [SD8]
L33  SD8  [SD8]
L34  SD8  [SD8]
L35  SD8  [SD8]
L36  SD8  [SD8]
L37  SD8  [SD8]
L38  SD8  [SD8]
L39  SD8  [SD8]
L40  SD8  [SD8]
L41  SD8  [SD8]
L42  SD8  [SD8]
L43  SD8  [SD8]
L44  SD8  [SD8]
L45  SD8  [SD8]
L46  SD8  [SD8]
L47  SD8  [SD8]
L48  SD8  [SD8]
L65  SD8  [SD8]
L66  SD8  [SD8]
L67  SD8  [SD8]
L68  SD8  [SD8]
L69  SD8  [SD8]
L70  SD8  [SD8]
L71  SD8  [SD8]
L72  SD8  [SD8]
L73  SD8  [SD8]
L74  SD8  [SD8]
L75  SD8  [SD8]
L76  SD8  [SD8]
L77  SD8  [SD8]
L78  SD8  [SD8]
L79  SD8  [SD8]
L80  SD8  [SD8]
L97  SD8  [SD8]
L98  SD8  [SD8]
L99  SD8  [SD8]
L100  SD8  [SD8]
L101  SD8  [SD8]
L102  SD8  [SD8]
L103  SD8  [SD8]
L104  SD8  [SD8]
L105  SD8  [SD8]
L106  SD8  [SD8]
L107  SD8  [SD8]
L108  SD8  [SD8]
L109  SD8  [SD8]
L110  SD8  [SD8]
L111  SD8  [SD8]
L112  SD8  [SD8]
L129  SD8  [SD8]
L130  SD8  [SD8]
L131  SD8  [SD8]
L132  SD8  [SD8]
L133  SD8  [SD8]
L134  SD8  [SD8]
L135  SD8  [SD8]
L136  SD8  [SD8]
L137  SD8  [SD8]
L138  SD8  [SD8]
L139  SD8  [SD8]
L140  SD8  [SD8]
L141  SD8  [SD8]
L142  SD8  [SD8]
L143  SD8  [SD8]
L144  SD8  [SD8]
L161  SD8  [SD8]
L162  SD8  [SD8]
L163  SD8  [SD8]
L164  SD8  [SD8]
L165  SD8  [SD8]
L166  SD8  [SD8]
L167  SD8  [SD8]
L168  SD8  [SD8]
L169  SD8  [SD8]
L170  SD8  [SD8]
L171  SD8  [SD8]
L172  SD8  [SD8]
L173  SD8  [SD8]
L174  SD8  [SD8]
L175  SD8  [SD8]
L176  SD8  [SD8]
L193  SD8  [SD8]
L194  SD8  [SD8]
L195  SD8  [SD8]
L196  SD8  [SD8]
L197  SD8  [SD8]
L198  SD8  [SD8]
L199  SD8  [SD8]
L200  SD8  [SD8]
L201  SD8  [SD8]
L202  SD8  [SD8]
L203  SD8  [SD8]
L204  SD8  [SD8]
L205  SD8  [SD8]
L206  SD8  [SD8]
L207  SD8  [SD8]
L208  SD8  [SD8]
L225  SD8  [SD8]
L226  SD8  [SD8]
L227  SD8  [SD8]
L228  SD8  [SD8]
L229  SD8  [SD8]
L230  SD8  [SD8]
L231  SD8  [SD8]
L232  SD8  [SD8]
L233  SD8  [SD8]
L234  SD8  [SD8]
L235  SD8  [SD8]
L236  SD8  [SD8]
L237  SD8  [SD8]
L238  SD8  [SD8]
L239  SD8  [SD8]
L240  SD8  [SD8]
L257  SD8  [SD8]
L258  SD8  [SD8]
L259  SD8  [SD8]
L260  SD8  [SD8]
L261  SD8  [SD8]
L262  SD8  [SD8]
L263  SD8  [SD8]
L264  SD8  [SD8]
L265  SD8  [SD8]
L266  SD8  [SD8]
L267  SD8  [SD8]
L268  SD8  [SD8]
L269  SD8  [SD8]
L270  SD8  [SD8]
L271  SD8  [SD8]
L272  SD8  [SD8]
L289  SD8  [SD8]
L290  SD8  [SD8]
L291  SD8  [SD8]
L292  SD8  [SD8]
L293  SD8  [SD8]
L294  SD8  [SD8]
L295  SD8  [SD8]
L296  SD8  [SD8]
L297  SD8  [SD8]
L298  SD8  [SD8]
L299  SD8  [SD8]
L300  SD8  [SD8]
L301  SD8  [SD8]
L302  SD8  [SD8]
L303  SD8  [SD8]
L304  SD8  [SD8]
L321  SD8  [SD8]
L322  SD8  [SD8]
L323  SD8  [SD8]
L324  SD8  [SD8]
L325  SD8  [SD8]
L326  SD8  [SD8]
L327  SD8  [SD8]
L328  SD8  [SD8]
L329  SD8  [SD8]
L330  SD8  [SD8]
L331  SD8  [SD8]
L332  SD8  [SD8]
L333  SD8  [SD8]
L334  SD8  [SD8]
L335  SD8  [SD8]
L336  SD8  [SD8]
L353  SD8  [SD8]
L354  SD8  [SD8]
L355  SD8  [SD8]
L356  SD8  [SD8]
L357  SD8  [SD8]
L358  SD8  [SD8]
L359  SD8  [SD8]
L360  SD8  [SD8]
L361  SD8  [SD8]
L362  SD8  [SD8]
L363  SD8  [SD8]
L364  SD8  [SD8]
L365  SD8  [SD8]
L366  SD8  [SD8]
L367  SD8  [SD8]
L368  SD8  [SD8]
L385  SD8  [SD8]
L386  SD8  [SD8]
L387  SD8  [SD8]
L388  SD8  [SD8]
L389  SD8  [SD8]
L390  SD8  [SD8]
L391  SD8  [SD8]
L392  SD8  [SD8]
L393  SD8  [SD8]
L394  SD8  [SD8]
L395  SD8  [SD8]
L396  SD8  [SD8]
L397  SD8  [SD8]
L398  SD8  [SD8]
L399  SD8  [SD8]
L400  SD8  [SD8]
L417  SD8  [SD8]
L418  SD8  [SD8]
L419  SD8  [SD8]
L420  SD8  [SD8]
L421  SD8  [SD8]
L422  SD8  [SD8]
L423  SD8  [SD8]
L424  SD8  [SD8]
L425  SD8  [SD8]
L426  SD8  [SD8]
L427  SD8  [SD8]
L428  SD8  [SD8]
L429  SD8  [SD8]
L430  SD8  [SD8]
L431  SD8  [SD8]
L432  SD8  [SD8]
L449  SD8  [SD8]
L450  SD8  [SD8]
L451  SD8  [SD8]
L452  SD8  [SD8]
L453  SD8  [SD8]
L454  SD8  [SD8]
L455  SD8  [SD8]
L456  SD8  [SD8]
L457  SD8  [SD8]
L458  SD8  [SD8]
L459  SD8  [SD8]
L460  SD8  [SD8]
L461  SD8  [SD8]
L462  SD8  [SD8]
L463  SD8  [SD8]
L464  SD8  [SD8]
L481  SD8  [SD8]
L482  SD8  [SD8]
L483  SD8  [SD8]
L484  SD8  [SD8]
L485  SD8  [SD8]
L486  SD8  [SD8]
L487  SD8  [SD8]
L488  SD8  [SD8]
L489  SD8  [SD8]
L490  SD8  [SD8]
L491  SD8  [SD8]
L492  SD8  [SD8]
L493  SD8  [SD8]
L494  SD8  [SD8]
L495  SD8  [SD8]
L496  SD8  [SD8]

### Nets
COL1: L1.2 L33.2 L65.2 L97.2 L129.2 L161.2 L193.2 L225.2 L257.2 L289.2 L321.2 L353.2 L385.2 L417.2 L449.2 L481.2 ; also sheet 3,6
COL2: L2.2 L34.2 L66.2 L98.2 L130.2 L162.2 L194.2 L226.2 L258.2 L290.2 L322.2 L354.2 L386.2 L418.2 L450.2 L482.2 ; also sheet 3,6
COL3: L3.2 L35.2 L67.2 L99.2 L131.2 L163.2 L195.2 L227.2 L259.2 L291.2 L323.2 L355.2 L387.2 L419.2 L451.2 L483.2 ; also sheet 3,6
COL4: L4.2 L36.2 L68.2 L100.2 L132.2 L164.2 L196.2 L228.2 L260.2 L292.2 L324.2 L356.2 L388.2 L420.2 L452.2 L484.2 ; also sheet 3,6
COL5: L5.2 L37.2 L69.2 L101.2 L133.2 L165.2 L197.2 L229.2 L261.2 L293.2 L325.2 L357.2 L389.2 L421.2 L453.2 L485.2 ; also sheet 3,6
COL6: L6.2 L38.2 L70.2 L102.2 L134.2 L166.2 L198.2 L230.2 L262.2 L294.2 L326.2 L358.2 L390.2 L422.2 L454.2 L486.2 ; also sheet 3,6
COL7: L7.2 L39.2 L71.2 L103.2 L135.2 L167.2 L199.2 L231.2 L263.2 L295.2 L327.2 L359.2 L391.2 L423.2 L455.2 L487.2 ; also sheet 3,6
COL8: L8.2 L40.2 L72.2 L104.2 L136.2 L168.2 L200.2 L232.2 L264.2 L296.2 L328.2 L360.2 L392.2 L424.2 L456.2 L488.2 ; also sheet 3,6
COL9: L9.2 L41.2 L73.2 L105.2 L137.2 L169.2 L201.2 L233.2 L265.2 L297.2 L329.2 L361.2 L393.2 L425.2 L457.2 L489.2 ; also sheet 3,6
COL10: L10.2 L42.2 L74.2 L106.2 L138.2 L170.2 L202.2 L234.2 L266.2 L298.2 L330.2 L362.2 L394.2 L426.2 L458.2 L490.2 ; also sheet 3,6
COL11: L11.2 L43.2 L75.2 L107.2 L139.2 L171.2 L203.2 L235.2 L267.2 L299.2 L331.2 L363.2 L395.2 L427.2 L459.2 L491.2 ; also sheet 3,6
COL12: L12.2 L44.2 L76.2 L108.2 L140.2 L172.2 L204.2 L236.2 L268.2 L300.2 L332.2 L364.2 L396.2 L428.2 L460.2 L492.2 ; also sheet 3,6
COL13: L13.2 L45.2 L77.2 L109.2 L141.2 L173.2 L205.2 L237.2 L269.2 L301.2 L333.2 L365.2 L397.2 L429.2 L461.2 L493.2 ; also sheet 3,6
COL14: L14.2 L46.2 L78.2 L110.2 L142.2 L174.2 L206.2 L238.2 L270.2 L302.2 L334.2 L366.2 L398.2 L430.2 L462.2 L494.2 ; also sheet 3,6
COL15: L15.2 L47.2 L79.2 L111.2 L143.2 L175.2 L207.2 L239.2 L271.2 L303.2 L335.2 L367.2 L399.2 L431.2 L463.2 L495.2 ; also sheet 3,6
COL16: L16.2 L48.2 L80.2 L112.2 L144.2 L176.2 L208.2 L240.2 L272.2 L304.2 L336.2 L368.2 L400.2 L432.2 L464.2 L496.2 ; also sheet 3,6
N$8: D1.3(COM) L1.1
N$9: D2.3(COM) L2.1
N$15: D3.3(COM) L3.1
N$17: D4.3(COM) L4.1
N$18: D5.3(COM) L5.1
N$19: D6.3(COM) L6.1
N$20: D7.3(COM) L7.1
N$21: D8.3(COM) L8.1
N$22: D9.3(COM) L9.1
N$23: D10.3(COM) L10.1
N$24: D11.3(COM) L11.1
N$25: D12.3(COM) L12.1
N$26: D13.3(COM) L13.1
N$27: D14.3(COM) L14.1
N$28: D15.3(COM) L15.1
N$29: D16.3(COM) L16.1
N$47: D33.3(COM) L33.1
N$48: D34.3(COM) L34.1
N$49: D35.3(COM) L35.1
N$50: D36.3(COM) L36.1
N$51: D37.3(COM) L37.1
N$52: D38.3(COM) L38.1
N$53: D39.3(COM) L39.1
N$54: D40.3(COM) L40.1
N$55: D41.3(COM) L41.1
N$56: D42.3(COM) L42.1
N$57: D43.3(COM) L43.1
N$58: D44.3(COM) L44.1
N$59: D45.3(COM) L45.1
N$60: D46.3(COM) L46.1
N$61: D47.3(COM) L47.1
N$62: D48.3(COM) L48.1
N$79: D65.3(COM) L65.1
N$80: D66.3(COM) L66.1
N$81: D67.3(COM) L67.1
N$82: D68.3(COM) L68.1
N$83: D69.3(COM) L69.1
N$84: D70.3(COM) L70.1
N$85: D71.3(COM) L71.1
N$86: D72.3(COM) L72.1
N$87: D73.3(COM) L73.1
N$88: D74.3(COM) L74.1
N$89: D75.3(COM) L75.1
N$90: D76.3(COM) L76.1
N$91: D77.3(COM) L77.1
N$92: D78.3(COM) L78.1
N$93: D79.3(COM) L79.1
N$94: D80.3(COM) L80.1
N$111: D97.3(COM) L97.1
N$112: D98.3(COM) L98.1
N$113: D99.3(COM) L99.1
N$114: D100.3(COM) L100.1
N$115: D101.3(COM) L101.1
N$116: D102.3(COM) L102.1
N$117: D103.3(COM) L103.1
N$118: D104.3(COM) L104.1
N$119: D105.3(COM) L105.1
N$120: D106.3(COM) L106.1
N$121: D107.3(COM) L107.1
N$122: D108.3(COM) L108.1
N$123: D109.3(COM) L109.1
N$124: D110.3(COM) L110.1
N$125: D111.3(COM) L111.1
N$126: D112.3(COM) L112.1
N$143: D129.3(COM) L129.1
N$144: D130.3(COM) L130.1
N$145: D131.3(COM) L131.1
N$146: D132.3(COM) L132.1
N$147: D133.3(COM) L133.1
N$148: D134.3(COM) L134.1
N$149: D135.3(COM) L135.1
N$150: D136.3(COM) L136.1
N$151: D137.3(COM) L137.1
N$152: D138.3(COM) L138.1
N$153: D139.3(COM) L139.1
N$154: D140.3(COM) L140.1
N$155: D141.3(COM) L141.1
N$156: D142.3(COM) L142.1
N$157: D143.3(COM) L143.1
N$158: D144.3(COM) L144.1
N$175: D161.3(COM) L161.1
N$176: D162.3(COM) L162.1
N$177: D163.3(COM) L163.1
N$178: D164.3(COM) L164.1
N$179: D165.3(COM) L165.1
N$180: D166.3(COM) L166.1
N$181: D167.3(COM) L167.1
N$182: D168.3(COM) L168.1
N$183: D169.3(COM) L169.1
N$184: D170.3(COM) L170.1
N$185: D171.3(COM) L171.1
N$186: D172.3(COM) L172.1
N$187: D173.3(COM) L173.1
N$188: D174.3(COM) L174.1
N$189: D175.3(COM) L175.1
N$190: D176.3(COM) L176.1
N$207: D193.3(COM) L193.1
N$208: D194.3(COM) L194.1
N$209: D195.3(COM) L195.1
N$210: D196.3(COM) L196.1
N$211: D197.3(COM) L197.1
N$212: D198.3(COM) L198.1
N$213: D199.3(COM) L199.1
N$214: D200.3(COM) L200.1
N$215: D201.3(COM) L201.1
N$216: D202.3(COM) L202.1
N$217: D203.3(COM) L203.1
N$218: D204.3(COM) L204.1
N$219: D205.3(COM) L205.1
N$220: D206.3(COM) L206.1
N$221: D207.3(COM) L207.1
N$222: D208.3(COM) L208.1
N$239: D225.3(COM) L225.1
N$240: D226.3(COM) L226.1
N$241: D227.3(COM) L227.1
N$242: D228.3(COM) L228.1
N$243: D229.3(COM) L229.1
N$244: D230.3(COM) L230.1
N$245: D231.3(COM) L231.1
N$246: D232.3(COM) L232.1
N$247: D233.3(COM) L233.1
N$248: D234.3(COM) L234.1
N$249: D235.3(COM) L235.1
N$250: D236.3(COM) L236.1
N$251: D237.3(COM) L237.1
N$252: D238.3(COM) L238.1
N$253: D239.3(COM) L239.1
N$254: D240.3(COM) L240.1
N$271: D257.3(COM) L257.1
N$272: D258.3(COM) L258.1
N$273: D259.3(COM) L259.1
N$274: D260.3(COM) L260.1
N$275: D261.3(COM) L261.1
N$276: D262.3(COM) L262.1
N$277: D263.3(COM) L263.1
N$278: D264.3(COM) L264.1
N$279: D265.3(COM) L265.1
N$280: D266.3(COM) L266.1
N$281: D267.3(COM) L267.1
N$282: D268.3(COM) L268.1
N$283: D269.3(COM) L269.1
N$284: D270.3(COM) L270.1
N$285: D271.3(COM) L271.1
N$286: D272.3(COM) L272.1
N$303: D289.3(COM) L289.1
N$304: D290.3(COM) L290.1
N$305: D291.3(COM) L291.1
N$306: D292.3(COM) L292.1
N$307: D293.3(COM) L293.1
N$308: D294.3(COM) L294.1
N$309: D295.3(COM) L295.1
N$310: D296.3(COM) L296.1
N$311: D297.3(COM) L297.1
N$312: D298.3(COM) L298.1
N$313: D299.3(COM) L299.1
N$314: D300.3(COM) L300.1
N$315: D301.3(COM) L301.1
N$316: D302.3(COM) L302.1
N$317: D303.3(COM) L303.1
N$318: D304.3(COM) L304.1
N$335: D321.3(COM) L321.1
N$336: D322.3(COM) L322.1
N$337: D323.3(COM) L323.1
N$338: D324.3(COM) L324.1
N$339: D325.3(COM) L325.1
N$340: D326.3(COM) L326.1
N$341: D327.3(COM) L327.1
N$342: D328.3(COM) L328.1
N$343: D329.3(COM) L329.1
N$344: D330.3(COM) L330.1
N$345: D331.3(COM) L331.1
N$346: D332.3(COM) L332.1
N$347: D333.3(COM) L333.1
N$348: D334.3(COM) L334.1
N$349: D335.3(COM) L335.1
N$350: D336.3(COM) L336.1
N$367: D353.3(COM) L353.1
N$368: D354.3(COM) L354.1
N$369: D355.3(COM) L355.1
N$370: D356.3(COM) L356.1
N$371: D357.3(COM) L357.1
N$372: D358.3(COM) L358.1
N$373: D359.3(COM) L359.1
N$374: D360.3(COM) L360.1
N$375: D361.3(COM) L361.1
N$376: D362.3(COM) L362.1
N$377: D363.3(COM) L363.1
N$378: D364.3(COM) L364.1
N$379: D365.3(COM) L365.1
N$380: D366.3(COM) L366.1
N$381: D367.3(COM) L367.1
N$382: D368.3(COM) L368.1
N$399: D385.3(COM) L385.1
N$400: D386.3(COM) L386.1
N$401: D387.3(COM) L387.1
N$402: D388.3(COM) L388.1
N$403: D389.3(COM) L389.1
N$404: D390.3(COM) L390.1
N$405: D391.3(COM) L391.1
N$406: D392.3(COM) L392.1
N$407: D393.3(COM) L393.1
N$408: D394.3(COM) L394.1
N$409: D395.3(COM) L395.1
N$410: D396.3(COM) L396.1
N$411: D397.3(COM) L397.1
N$412: D398.3(COM) L398.1
N$413: D399.3(COM) L399.1
N$414: D400.3(COM) L400.1
N$431: D417.3(COM) L417.1
N$432: D418.3(COM) L418.1
N$433: D419.3(COM) L419.1
N$434: D420.3(COM) L420.1
N$435: D421.3(COM) L421.1
N$436: D422.3(COM) L422.1
N$437: D423.3(COM) L423.1
N$438: D424.3(COM) L424.1
N$439: D425.3(COM) L425.1
N$440: D426.3(COM) L426.1
N$441: D427.3(COM) L427.1
N$442: D428.3(COM) L428.1
N$443: D429.3(COM) L429.1
N$444: D430.3(COM) L430.1
N$445: D431.3(COM) L431.1
N$446: D432.3(COM) L432.1
N$463: D449.3(COM) L449.1
N$464: D450.3(COM) L450.1
N$465: D451.3(COM) L451.1
N$466: D452.3(COM) L452.1
N$467: D453.3(COM) L453.1
N$468: D454.3(COM) L454.1
N$469: D455.3(COM) L455.1
N$470: D456.3(COM) L456.1
N$471: D457.3(COM) L457.1
N$472: D458.3(COM) L458.1
N$473: D459.3(COM) L459.1
N$474: D460.3(COM) L460.1
N$475: D461.3(COM) L461.1
N$476: D462.3(COM) L462.1
N$477: D463.3(COM) L463.1
N$478: D464.3(COM) L464.1
N$495: D481.3(COM) L481.1
N$496: D482.3(COM) L482.1
N$497: D483.3(COM) L483.1
N$498: D484.3(COM) L484.1
N$499: D485.3(COM) L485.1
N$500: D486.3(COM) L486.1
N$501: D487.3(COM) L487.1
N$502: D488.3(COM) L488.1
N$503: D489.3(COM) L489.1
N$504: D490.3(COM) L490.1
N$505: D491.3(COM) L491.1
N$506: D492.3(COM) L492.1
N$507: D493.3(COM) L493.1
N$508: D494.3(COM) L494.1
N$509: D495.3(COM) L495.1
N$510: D496.3(COM) L496.1
ROW1_SINK: D1.1(A1) D2.1(A1) D3.1(A1) D4.1(A1) D5.1(A1) D6.1(A1) D7.1(A1) D8.1(A1) D9.1(A1) D10.1(A1) D11.1(A1) D12.1(A1) D13.1(A1) D14.1(A1) D15.1(A1) D16.1(A1) ; also sheet 2,5
ROW1_SOURCE: D1.2(C2) D2.2(C2) D3.2(C2) D4.2(C2) D5.2(C2) D6.2(C2) D7.2(C2) D8.2(C2) D9.2(C2) D10.2(C2) D11.2(C2) D12.2(C2) D13.2(C2) D14.2(C2) D15.2(C2) D16.2(C2) ; also sheet 2,5
ROW2_SINK: D33.1(A1) D34.1(A1) D35.1(A1) D36.1(A1) D37.1(A1) D38.1(A1) D39.1(A1) D40.1(A1) D41.1(A1) D42.1(A1) D43.1(A1) D44.1(A1) D45.1(A1) D46.1(A1) D47.1(A1) D48.1(A1) ; also sheet 2,5
ROW2_SOURCE: D33.2(C2) D34.2(C2) D35.2(C2) D36.2(C2) D37.2(C2) D38.2(C2) D39.2(C2) D40.2(C2) D41.2(C2) D42.2(C2) D43.2(C2) D44.2(C2) D45.2(C2) D46.2(C2) D47.2(C2) D48.2(C2) ; also sheet 2,5
ROW3_SINK: D65.1(A1) D66.1(A1) D67.1(A1) D68.1(A1) D69.1(A1) D70.1(A1) D71.1(A1) D72.1(A1) D73.1(A1) D74.1(A1) D75.1(A1) D76.1(A1) D77.1(A1) D78.1(A1) D79.1(A1) D80.1(A1) ; also sheet 2,5
ROW3_SOURCE: D65.2(C2) D66.2(C2) D67.2(C2) D68.2(C2) D69.2(C2) D70.2(C2) D71.2(C2) D72.2(C2) D73.2(C2) D74.2(C2) D75.2(C2) D76.2(C2) D77.2(C2) D78.2(C2) D79.2(C2) D80.2(C2) ; also sheet 2,5
ROW4_SINK: D97.1(A1) D98.1(A1) D99.1(A1) D100.1(A1) D101.1(A1) D102.1(A1) D103.1(A1) D104.1(A1) D105.1(A1) D106.1(A1) D107.1(A1) D108.1(A1) D109.1(A1) D110.1(A1) D111.1(A1) D112.1(A1) ; also sheet 2,5
ROW4_SOURCE: D97.2(C2) D98.2(C2) D99.2(C2) D100.2(C2) D101.2(C2) D102.2(C2) D103.2(C2) D104.2(C2) D105.2(C2) D106.2(C2) D107.2(C2) D108.2(C2) D109.2(C2) D110.2(C2) D111.2(C2) D112.2(C2) ; also sheet 2,5
ROW5_SINK: D129.1(A1) D130.1(A1) D131.1(A1) D132.1(A1) D133.1(A1) D134.1(A1) D135.1(A1) D136.1(A1) D137.1(A1) D138.1(A1) D139.1(A1) D140.1(A1) D141.1(A1) D142.1(A1) D143.1(A1) D144.1(A1) ; also sheet 2,5
ROW5_SOURCE: D129.2(C2) D130.2(C2) D131.2(C2) D132.2(C2) D133.2(C2) D134.2(C2) D135.2(C2) D136.2(C2) D137.2(C2) D138.2(C2) D139.2(C2) D140.2(C2) D141.2(C2) D142.2(C2) D143.2(C2) D144.2(C2) ; also sheet 2,5
ROW6_SINK: D161.1(A1) D162.1(A1) D163.1(A1) D164.1(A1) D165.1(A1) D166.1(A1) D167.1(A1) D168.1(A1) D169.1(A1) D170.1(A1) D171.1(A1) D172.1(A1) D173.1(A1) D174.1(A1) D175.1(A1) D176.1(A1) ; also sheet 2,5
ROW6_SOURCE: D161.2(C2) D162.2(C2) D163.2(C2) D164.2(C2) D165.2(C2) D166.2(C2) D167.2(C2) D168.2(C2) D169.2(C2) D170.2(C2) D171.2(C2) D172.2(C2) D173.2(C2) D174.2(C2) D175.2(C2) D176.2(C2) ; also sheet 2,5
ROW7_SINK: D193.1(A1) D194.1(A1) D195.1(A1) D196.1(A1) D197.1(A1) D198.1(A1) D199.1(A1) D200.1(A1) D201.1(A1) D202.1(A1) D203.1(A1) D204.1(A1) D205.1(A1) D206.1(A1) D207.1(A1) D208.1(A1) ; also sheet 2,5
ROW7_SOURCE: D193.2(C2) D194.2(C2) D195.2(C2) D196.2(C2) D197.2(C2) D198.2(C2) D199.2(C2) D200.2(C2) D201.2(C2) D202.2(C2) D203.2(C2) D204.2(C2) D205.2(C2) D206.2(C2) D207.2(C2) D208.2(C2) ; also sheet 2,5
ROW8_SINK: D225.1(A1) D226.1(A1) D227.1(A1) D228.1(A1) D229.1(A1) D230.1(A1) D231.1(A1) D232.1(A1) D233.1(A1) D234.1(A1) D235.1(A1) D236.1(A1) D237.1(A1) D238.1(A1) D239.1(A1) D240.1(A1) ; also sheet 2,5
ROW8_SOURCE: D225.2(C2) D226.2(C2) D227.2(C2) D228.2(C2) D229.2(C2) D230.2(C2) D231.2(C2) D232.2(C2) D233.2(C2) D234.2(C2) D235.2(C2) D236.2(C2) D237.2(C2) D238.2(C2) D239.2(C2) D240.2(C2) ; also sheet 2,5
ROW9_SINK: D257.1(A1) D258.1(A1) D259.1(A1) D260.1(A1) D261.1(A1) D262.1(A1) D263.1(A1) D264.1(A1) D265.1(A1) D266.1(A1) D267.1(A1) D268.1(A1) D269.1(A1) D270.1(A1) D271.1(A1) D272.1(A1) ; also sheet 2,5
ROW9_SOURCE: D257.2(C2) D258.2(C2) D259.2(C2) D260.2(C2) D261.2(C2) D262.2(C2) D263.2(C2) D264.2(C2) D265.2(C2) D266.2(C2) D267.2(C2) D268.2(C2) D269.2(C2) D270.2(C2) D271.2(C2) D272.2(C2) ; also sheet 2,5
ROW10_SINK: D289.1(A1) D290.1(A1) D291.1(A1) D292.1(A1) D293.1(A1) D294.1(A1) D295.1(A1) D296.1(A1) D297.1(A1) D298.1(A1) D299.1(A1) D300.1(A1) D301.1(A1) D302.1(A1) D303.1(A1) D304.1(A1) ; also sheet 2,5
ROW10_SOURCE: D289.2(C2) D290.2(C2) D291.2(C2) D292.2(C2) D293.2(C2) D294.2(C2) D295.2(C2) D296.2(C2) D297.2(C2) D298.2(C2) D299.2(C2) D300.2(C2) D301.2(C2) D302.2(C2) D303.2(C2) D304.2(C2) ; also sheet 2,5
ROW11_SINK: D321.1(A1) D322.1(A1) D323.1(A1) D324.1(A1) D325.1(A1) D326.1(A1) D327.1(A1) D328.1(A1) D329.1(A1) D330.1(A1) D331.1(A1) D332.1(A1) D333.1(A1) D334.1(A1) D335.1(A1) D336.1(A1) ; also sheet 2,5
ROW11_SOURCE: D321.2(C2) D322.2(C2) D323.2(C2) D324.2(C2) D325.2(C2) D326.2(C2) D327.2(C2) D328.2(C2) D329.2(C2) D330.2(C2) D331.2(C2) D332.2(C2) D333.2(C2) D334.2(C2) D335.2(C2) D336.2(C2) ; also sheet 2,5
ROW12_SINK: D353.1(A1) D354.1(A1) D355.1(A1) D356.1(A1) D357.1(A1) D358.1(A1) D359.1(A1) D360.1(A1) D361.1(A1) D362.1(A1) D363.1(A1) D364.1(A1) D365.1(A1) D366.1(A1) D367.1(A1) D368.1(A1) ; also sheet 2,5
ROW12_SOURCE: D353.2(C2) D354.2(C2) D355.2(C2) D356.2(C2) D357.2(C2) D358.2(C2) D359.2(C2) D360.2(C2) D361.2(C2) D362.2(C2) D363.2(C2) D364.2(C2) D365.2(C2) D366.2(C2) D367.2(C2) D368.2(C2) ; also sheet 2,5
ROW13_SINK: D385.1(A1) D386.1(A1) D387.1(A1) D388.1(A1) D389.1(A1) D390.1(A1) D391.1(A1) D392.1(A1) D393.1(A1) D394.1(A1) D395.1(A1) D396.1(A1) D397.1(A1) D398.1(A1) D399.1(A1) D400.1(A1) ; also sheet 2,5
ROW13_SOURCE: D385.2(C2) D386.2(C2) D387.2(C2) D388.2(C2) D389.2(C2) D390.2(C2) D391.2(C2) D392.2(C2) D393.2(C2) D394.2(C2) D395.2(C2) D396.2(C2) D397.2(C2) D398.2(C2) D399.2(C2) D400.2(C2) ; also sheet 2,5
ROW14_SINK: D417.1(A1) D418.1(A1) D419.1(A1) D420.1(A1) D421.1(A1) D422.1(A1) D423.1(A1) D424.1(A1) D425.1(A1) D426.1(A1) D427.1(A1) D428.1(A1) D429.1(A1) D430.1(A1) D431.1(A1) D432.1(A1) ; also sheet 2,5
ROW14_SOURCE: D417.2(C2) D418.2(C2) D419.2(C2) D420.2(C2) D421.2(C2) D422.2(C2) D423.2(C2) D424.2(C2) D425.2(C2) D426.2(C2) D427.2(C2) D428.2(C2) D429.2(C2) D430.2(C2) D431.2(C2) D432.2(C2) ; also sheet 2,5
ROW15_SINK: D449.1(A1) D450.1(A1) D451.1(A1) D452.1(A1) D453.1(A1) D454.1(A1) D455.1(A1) D456.1(A1) D457.1(A1) D458.1(A1) D459.1(A1) D460.1(A1) D461.1(A1) D462.1(A1) D463.1(A1) D464.1(A1) ; also sheet 2,5
ROW15_SOURCE: D449.2(C2) D450.2(C2) D451.2(C2) D452.2(C2) D453.2(C2) D454.2(C2) D455.2(C2) D456.2(C2) D457.2(C2) D458.2(C2) D459.2(C2) D460.2(C2) D461.2(C2) D462.2(C2) D463.2(C2) D464.2(C2) ; also sheet 2,5
ROW16_SINK: D481.1(A1) D482.1(A1) D483.1(A1) D484.1(A1) D485.1(A1) D486.1(A1) D487.1(A1) D488.1(A1) D489.1(A1) D490.1(A1) D491.1(A1) D492.1(A1) D493.1(A1) D494.1(A1) D495.1(A1) D496.1(A1) ; also sheet 2,5
ROW16_SOURCE: D481.2(C2) D482.2(C2) D483.2(C2) D484.2(C2) D485.2(C2) D486.2(C2) D487.2(C2) D488.2(C2) D489.2(C2) D490.2(C2) D491.2(C2) D492.2(C2) D493.2(C2) D494.2(C2) D495.2(C2) D496.2(C2) ; also sheet 2,5